# EAGLE board Arm_Board_2018 (EAGLE 8.4.1), part 1 of 2
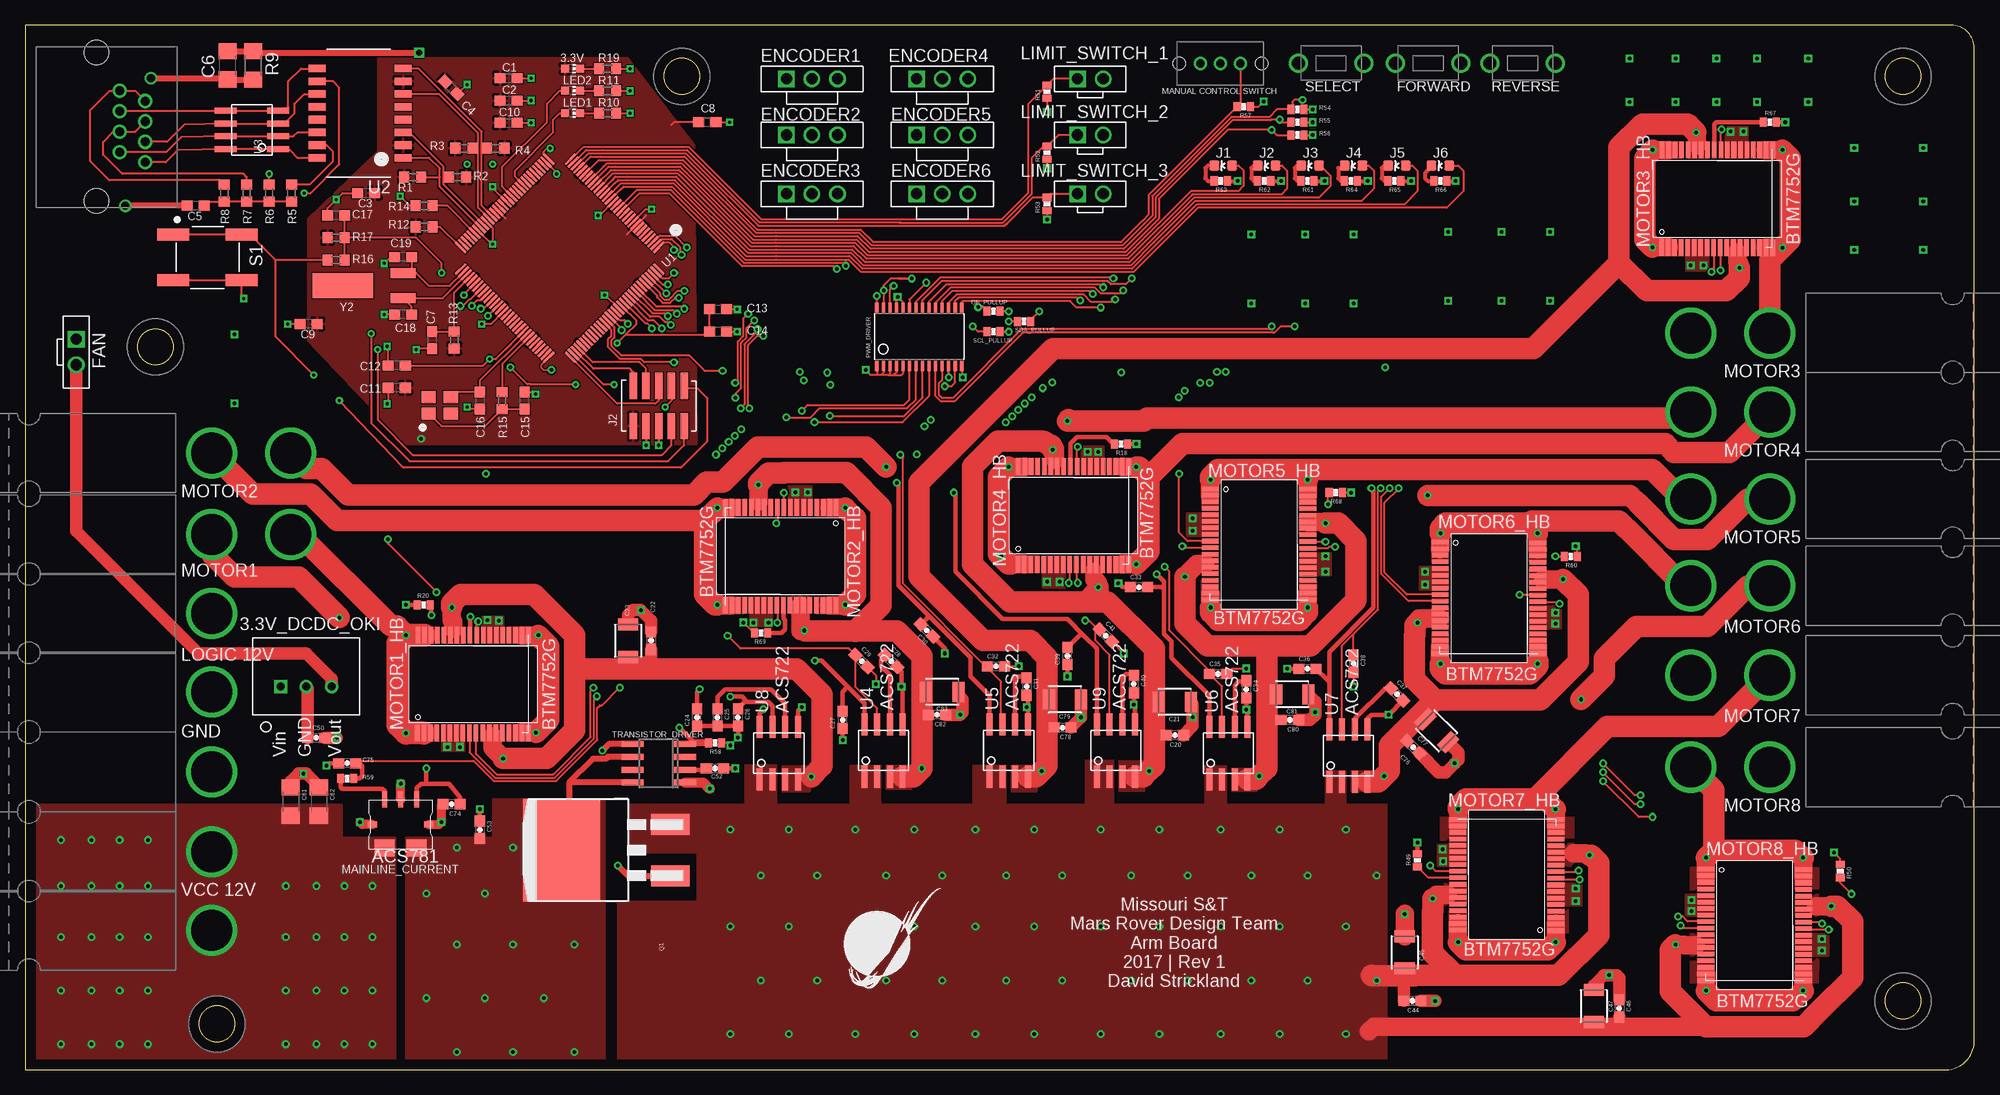
[diagram p4: board, top side]
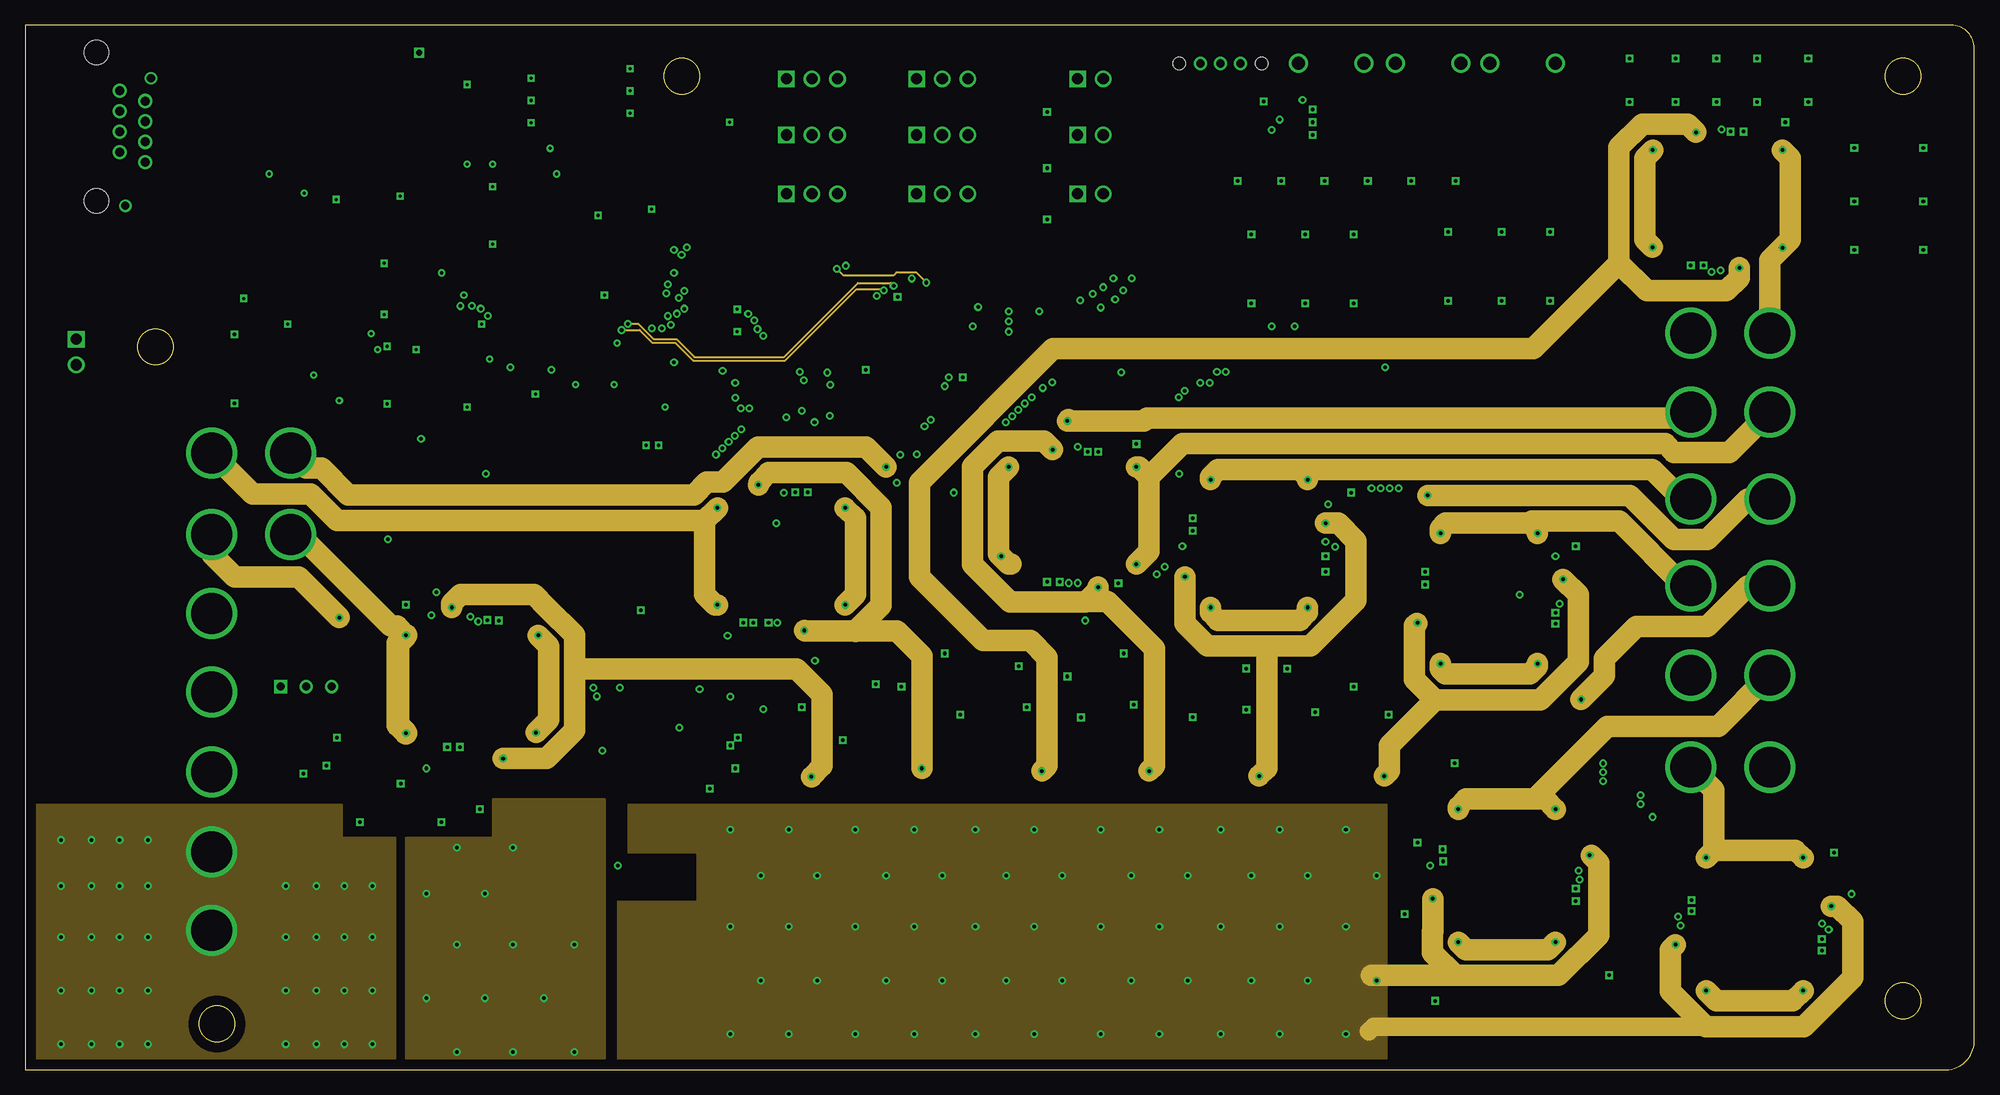
[diagram p5: board, inner layer Route2]
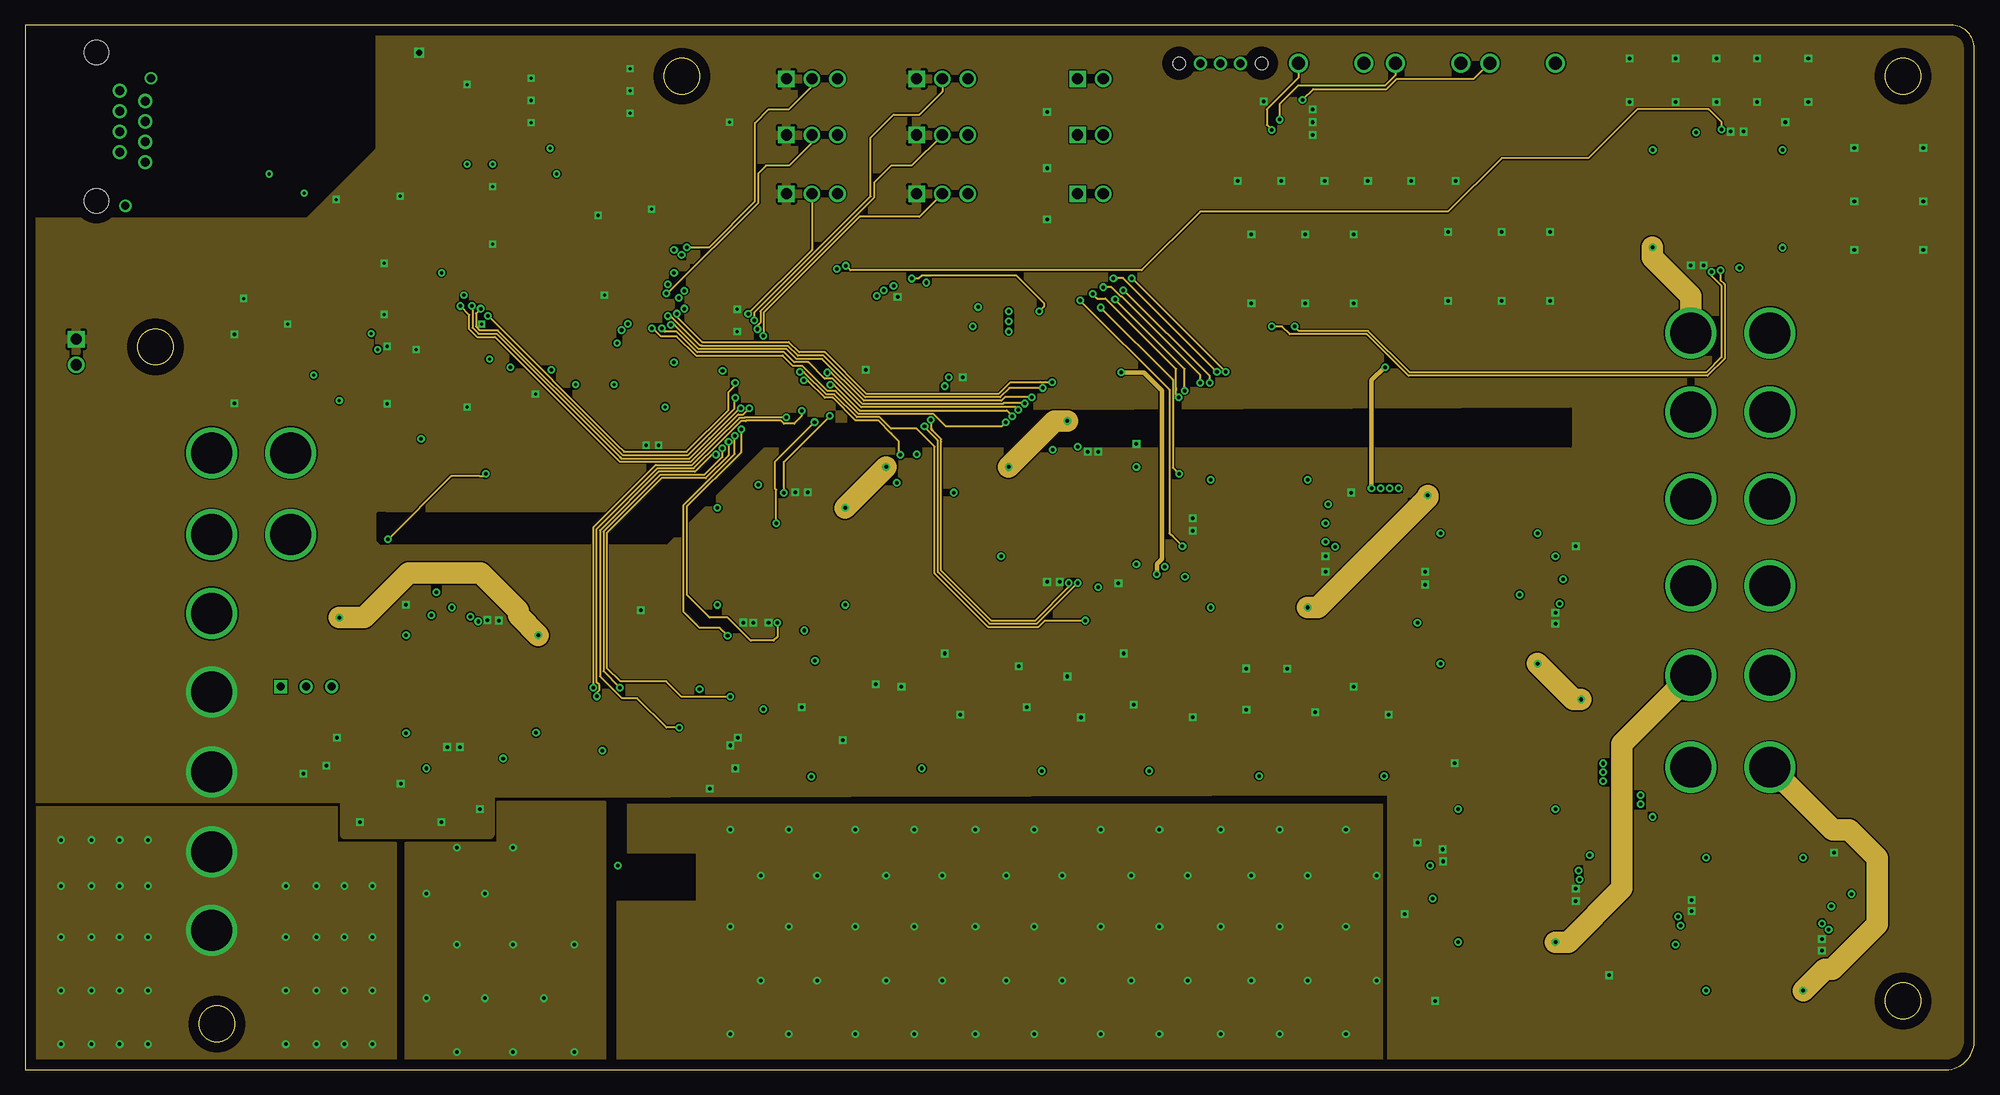
[diagram p6: board, inner layer Route15]
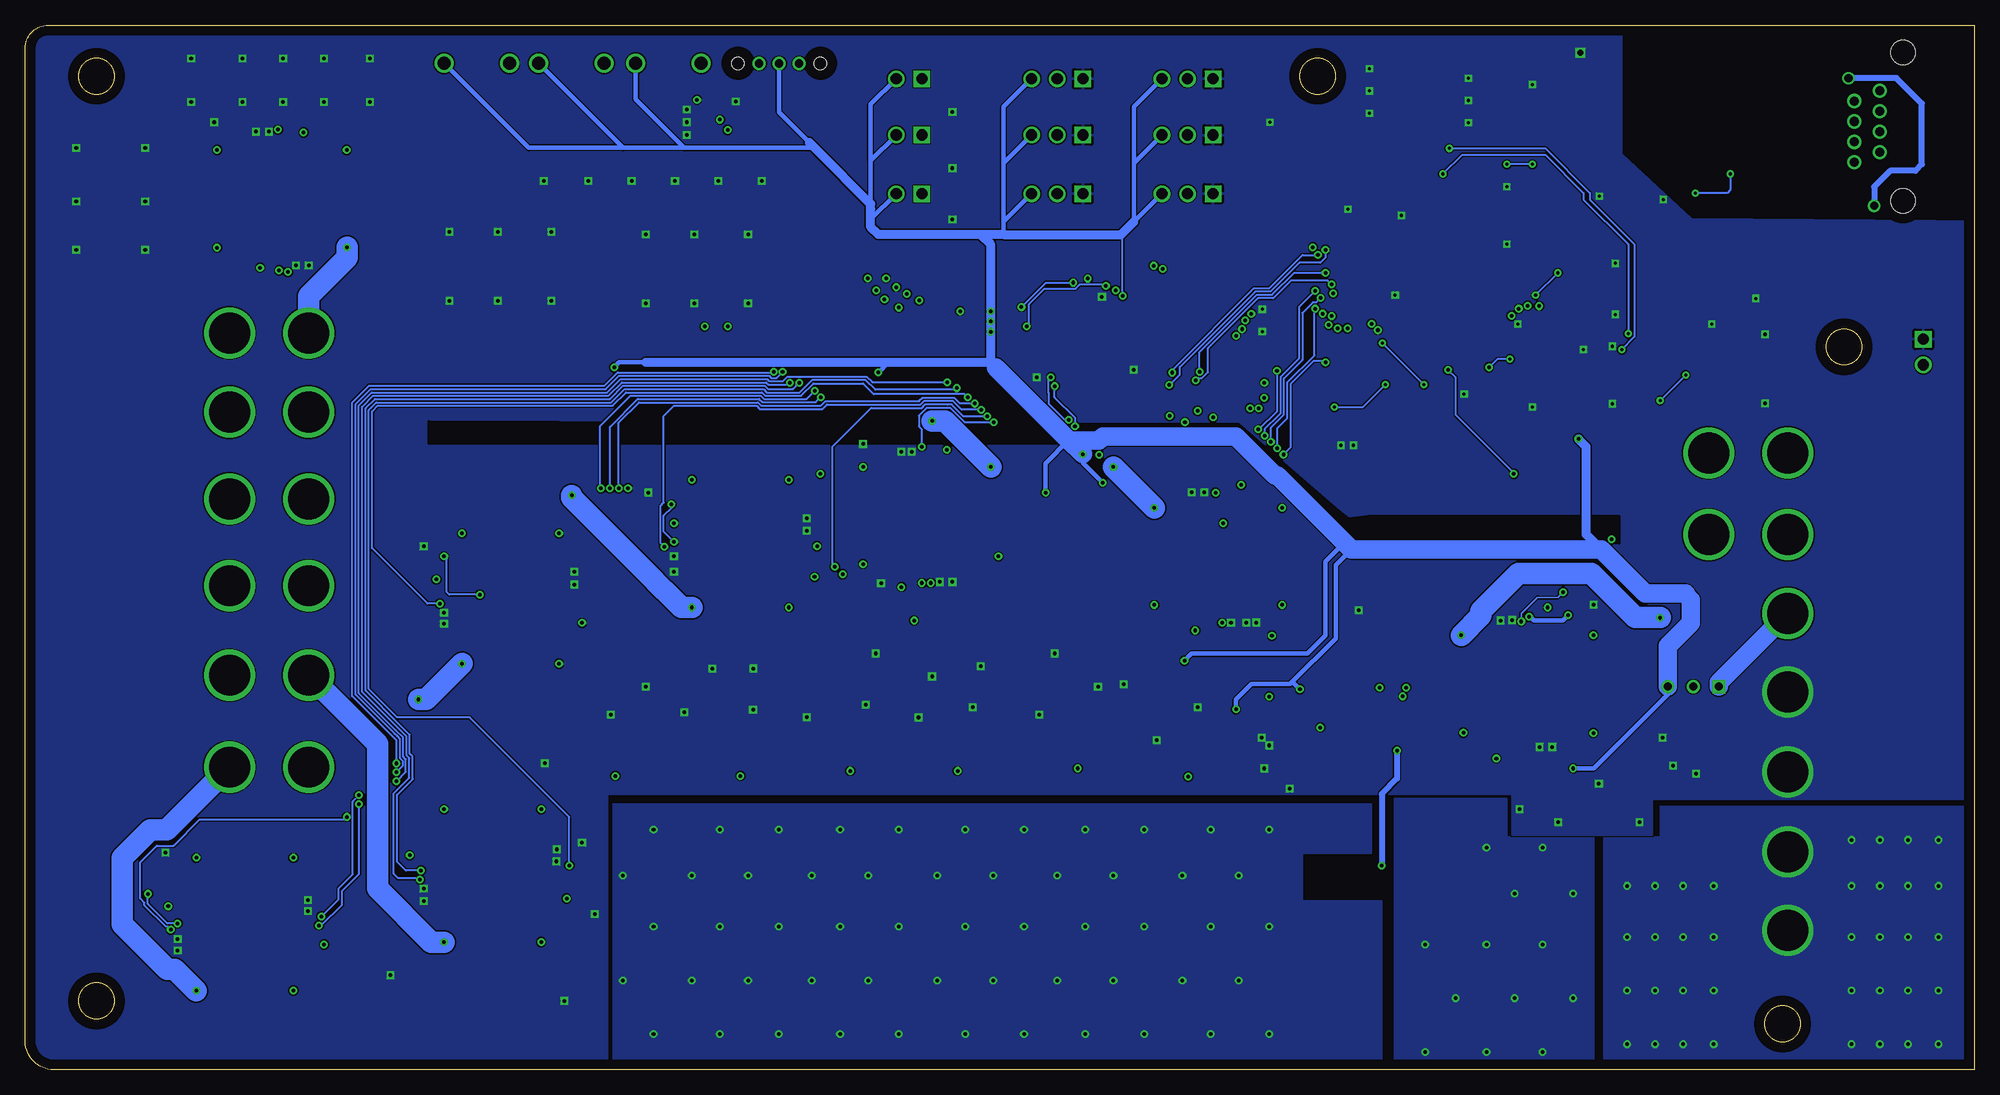
[diagram p7: board, bottom side, seen from below]

Size 193.8 x 103.89 mm. Coordinates in mm from the lower left corner, seen from the top.
Outline: 0,0 191.01,0 arc90 193.8,3.05 193.8,101.6 arc90 191.52,103.89 0,103.89 0,0
Copper layers (1*2*15*16): Top 0.07mm / dielectric 0.18mm / Route2 0.017mm / dielectric 1.12mm / Route15 0.017mm / dielectric 0.18mm / Bottom 0.07mm
Design rules "advanced_circuits_standard *": minimum track width 5mil, minimum drill 10mil, track to track 5mil, track to pad 5mil, pad to pad 5mil, via to via 5mil, smd to smd 5mil, copper to edge 40mil, drill to drill 5mil, minimum pad ring 10mil, minimum via ring 8mil, stop-mask expansion 4mil, vias tented up to drill 0mil, thermal gap 10mil
Net classes: 2 Ethernet: width 0.22 mm, clearance 0.152 mm; 3 Power Trace: width 1.829 mm, clearance 0.406 mm

## Footprints (pad centres in the part's own frame; a part is rotated, then mirrored left to right if it is on the bottom)
CHIP-LED0603 = smd 0.8 x 0.8: A 0,-0.75; C 0,0.75
Q_OKI-78SR = drill 0.8 square: 1 -2.54,0 | drill 0.8: 2 0,0; 3 2.54,0
APP45_PCB_HORIZ_RIGHT = drill 4.064: P$1 28.194,3.969
C0603 = smd 1.1 x 1: 1 -0.85,0; 2 0.85,0
C1206 = smd 1.6 x 1.8: 1 -1.4,0; 2 1.4,0
0603-CAP = smd 1.1 x 1: 1 -0.85,0; 2 0.85,0
1210 = smd 1.2 x 2: 1 -1.6,0; 2 1.6,0
1206 = smd 1.6 x 1.8: 1 -1.4,0; 2 1.4,0
LED-0603 = smd 1 x 1: A 0,-0.877; C 0,0.877
MOLEX-70543-0002 = drill 1.1 square: 1 2.54,0 | drill 1.1: 2 0,0; 3 -2.54,0
MOLEX-70543-0001 = drill 1.1 square: 1 1.27,0 | drill 1.1: 2 -1.27,0
KEYSTONE-942 = drill 0.9: P$1 3.8,2.289; P$2 4.816,4.829; P$3 5.832,2.289; P$4 6.848,4.829; P$5 7.864,2.289; P$6 8.88,4.829; P$7 9.896,2.289; P$8 10.912,4.829 | hole 2.413: -0.023,-0.023; 14.76,-0.023
CON_2X5_50MIL = smd 0.74 x 2.6: P1 0,0; P2 0,4.008; P3 1.27,0; P4 1.27,4.008; P5 2.54,0; P6 2.54,4.008; P7 3.81,0; P8 3.81,4.008; P9 5.08,0; P10 5.08,4.008
7-POWER_SMD_MODULE = smd 0.5 x 1.6: 1 -1.6,-2.5; 2 0,-2.5; 3 1.6,-2.5 | smd 0.9 x 0.6: 4 2.8,0; 7 -2.8,0 | smd 2 x 1.7: 5 1.6,2.3; 6 -1.6,2.3
APP45_HORIZ_CONFIG = drill 4.064: C1 28.194,3.937; C2 36.068,3.937
36-BSSOP = smd 1.67 x 0.45: 1 -4.86,11.05; 2 -4.86,10.4; 3 -4.86,9.75; 4 -4.86,9.1; 5 -4.86,8.45; 6 -4.86,7.8; 7 -4.86,7.15; 8 -4.86,6.5; 9 -4.86,5.85; 10 -4.86,5.2; 11 -4.86,4.55; 12 -4.86,3.9; 13 -4.86,3.25; 14 -4.86,2.6; 15 -4.86,1.95; 16 -4.86,1.3; 17 -4.86,0.65; 18 -4.87,0; 19 4.86,0; 20 4.86,0.65; 21 4.86,1.3; 22 4.86,1.95; 23 4.86,2.55; 24 4.86,3.2; 25 4.86,3.85; 26 4.86,4.5; 27 4.86,5.14; 28 4.86,5.8; 29 4.86,6.45; 30 4.86,7.1; 31 4.86,7.75; 32 4.86,8.4; 33 4.86,9.05; 34 4.86,9.7; 35 4.86,10.35; 36 4.86,11
0402-RES = smd 0.7 x 0.9: 1 -0.65,0; 2 0.65,0
TSSOP28 = smd 0.305 x 0.991: 1 -4.225,-2.918; 2 -3.575,-2.918; 3 -2.925,-2.918; 4 -2.275,-2.918; 5 -1.625,-2.918; 6 -0.975,-2.918; 7 -0.325,-2.918; 8 0.325,-2.918; 9 0.975,-2.918; 10 1.625,-2.918; 11 2.275,-2.918; 12 2.925,-2.918; 13 3.575,-2.918; 14 4.225,-2.918; 15 4.225,2.918; 16 3.575,2.918; 17 2.925,2.918; 18 2.275,2.918; 19 1.625,2.918; 20 0.975,2.918; 21 0.325,2.918; 22 -0.325,2.918; 23 -0.975,2.918; 24 -1.625,2.918; 25 -2.275,2.918; 26 -2.925,2.918; 27 -3.575,2.918; 28 -4.225,2.918
D2PACK = smd 2.083 x 3.81: 1 2.54,-4.191; 2 7.62,-4.191 | smd 10.16 x 7.62: TAB 5.08,6.604
R0603 = smd 1 x 1.1: 1 -0.85,0; 2 0.85,0
R1206 = smd 1.6 x 1.803: 1 -1.422,0; 2 1.422,0
SWITCH_6MM_6MM_TE_CON_SMD = smd 1.2 x 3.2: P$1 4.521,6.807; P$2 4.521,0; P$3 0,6.807; P$4 0,0
APEM-MJTP1243 = drill 1.27: P$1 -0.254,1.753; P$2 6.248,1.753
C&K-SS12D07VG4NSGAPA = drill 0.8: P$1 0,0; P$2 2,0; P$3 4,0 | hole 1.25: -2.1,0; 6.1,0
SO8 = smd 0.6 x 2.2: 1 -1.905,-2.6; 2 -0.635,-2.6; 3 0.635,-2.6; 4 1.905,-2.6; 5 1.905,2.6; 6 0.635,2.6; 7 -0.635,2.6; 8 -1.905,2.6
TQFP-128 = smd 1.45 x 0.25: P$1 0,0; P$2 0,-0.4; P$3 0,-0.8; P$4 0,-1.2; P$5 0,-1.6; P$6 0,-2; P$7 0,-2.4; P$8 0,-2.8; P$9 0,-3.2; P$10 0,-3.6; P$11 0,-4; P$12 0,-4.4; P$13 0,-4.8; P$14 0,-5.2; P$15 0,-5.6; P$16 0,-6; P$17 0,-6.4; P$18 0,-6.8; P$19 0,-7.2; P$20 0,-7.6; P$21 0,-8; P$22 0,-8.4; P$23 0,-8.8; P$24 0,-9.2; P$25 0,-9.6; P$26 0,-10; P$27 0,-10.4; P$28 0,-10.8; P$29 0,-11.2; P$30 0,-11.6; P$31 0,-12; P$32 0,-12.4; P$65 15.45,-12.4; P$66 15.45,-12; P$67 15.45,-11.6; P$68 15.45,-11.2; P$69 15.45,-10.8; P$70 15.45,-10.4; P$71 15.45,-10; P$72 15.45,-9.6; P$73 15.45,-9.2; P$74 15.45,-8.8; P$75 15.45,-8.4; P$76 15.45,-8; P$77 15.45,-7.6; P$78 15.45,-7.2; P$79 15.45,-6.8; P$80 15.45,-6.4; P$81 15.45,-6; P$82 15.45,-5.6; P$83 15.45,-5.2; P$84 15.45,-4.8; P$85 15.45,-4.4; P$86 15.45,-4; P$87 15.45,-3.6; P$88 15.45,-3.2; P$89 15.45,-2.8; P$90 15.45,-2.4; P$91 15.45,-2; P$92 15.45,-1.6; P$93 15.45,-1.2; P$94 15.45,-0.8; P$95 15.45,-0.4; P$96 15.45,0 | smd 0.25 x 1.45: P$33 1.525,-13.925; P$34 1.925,-13.925; P$35 2.325,-13.925; P$36 2.725,-13.925; P$37 3.125,-13.925; P$38 3.525,-13.925; P$39 3.925,-13.925; P$40 4.325,-13.925; P$41 4.725,-13.925; P$42 5.125,-13.925; P$43 5.525,-13.925; P$44 5.925,-13.925; P$45 6.325,-13.925; P$46 6.725,-13.925; P$47 7.125,-13.925; P$48 7.525,-13.925; P$49 7.925,-13.925; P$50 8.325,-13.925; P$51 8.725,-13.925; P$52 9.125,-13.925; P$53 9.525,-13.925; P$54 9.925,-13.925; P$55 10.325,-13.925; P$56 10.725,-13.925; P$57 11.125,-13.925; P$58 11.525,-13.925; P$59 11.925,-13.925; P$60 12.325,-13.925; P$61 12.725,-13.925; P$62 13.125,-13.925; P$63 13.525,-13.925; P$64 13.925,-13.925; P$97 13.925,1.525; P$98 13.525,1.525; P$99 13.125,1.525; P$100 12.725,1.525; P$101 12.325,1.525; P$102 11.925,1.525; P$103 11.525,1.525; P$104 11.125,1.525; P$105 10.725,1.525; P$106 10.325,1.525; P$107 9.925,1.525; P$108 9.525,1.525; P$109 9.125,1.525; P$110 8.725,1.525; P$111 8.325,1.525; P$112 7.925,1.525; P$113 7.525,1.525; P$114 7.125,1.525; P$115 6.725,1.525; P$116 6.325,1.525; P$117 5.925,1.525; P$118 5.525,1.525; P$119 5.125,1.525; P$120 4.725,1.525; P$121 4.325,1.525; P$122 3.925,1.525; P$123 3.525,1.525; P$124 3.125,1.525; P$125 2.725,1.525; P$126 2.325,1.525; P$127 1.925,1.525; P$128 1.525,1.525
HX1198FNL = smd 0.76 x 1.67: P$1 0,0; P$2 1.27,0; P$3 2.54,0; P$4 3.81,0; P$5 5.08,0; P$6 6.35,0; P$7 7.62,0; P$8 8.89,0; P$9 8.89,8.55; P$10 7.62,8.55; P$11 6.35,8.55; P$12 5.08,8.55; P$13 3.81,8.55; P$14 2.54,8.55; P$15 1.27,8.55; P$16 0,8.55
SOIC8 = smd 2.2 x 0.6: 1 -2.6,1.905; 2 -2.6,0.635; 3 -2.6,-0.635; 4 -2.6,-1.905; 5 2.6,-1.905; 6 2.6,-0.635; 7 2.6,0.635; 8 2.6,1.905
NDK3.2X2.5 = smd 1.4 x 1.2: P$1 0,0; P$2 2.2,0; P$3 2.2,1.6; P$4 0,1.6
CRYSTAL_32K_SMD = smd 2.5 x 1: P$1 0,1.25; P$2 0,-1.25 | smd 6 x 2.5: P$3 -6,0

## Placement (x,y rotation side)
3.3V  ORANGE  [CHIP-LED0603]  54.42,99.57 270 top
3.3V_DCDC_OKI  Q_OKI-78SR  [Q_OKI-78SR]  27.94,38.1 0 top
12V_LOGIC_IN  APPPP45_PCB_HORIZ_RIGHT  [APP45_PCB_HORIZ_RIGHT]  -9.65,41.4 0 top
C1  0.1uF  [C0603]  48.07,98.62 0 top
C2  0.1uF  [C0603]  48.07,96.39 0 top
C3  0.1uF  [C0603]  33.91,87.19 180 top
C4  0.1uF  [C0603]  42.35,97.66 315 top
C5  1000pF  [C0603]  16.95,85.92 180 top
C6  4700pF  [C1206]  20.13,99.89 90 top
C7  0.1uF  [C0603]  40.45,72.58 270 top
C8  0.1uF  [C0603]  67.82,94.23 0 top
C9  0.1uF  [C0603]  28.19,74.17 180 top
C10  0.1uF  [C0603]  48.07,94.17 0 top
C11  0.1uF  [C0603]  36.96,67.82 180 top
C12  0.1uF  [C0603]  36.96,70.04 180 top
C13  1.0uF  [C0603]  68.9,75.63 0 top
C14  2.2uF  [C0603]  68.9,73.41 0 top
C15  12pF  [C0603]  49.66,66.55 90 top
C16  12pF  [C0603]  45.21,66.55 270 top
C17  0.1uF  [C0603]  30.92,84.96 180 top
C18  12pF  [C0603]  37.59,75.12 180 top
C19  12pF  [C0603]  37.59,80.84 180 top
C20  .1uF  [0603-CAP]  114.3,33.27 180 top
C21  100uF  [1210]  114.3,36.58 180 top
C22  .1uF  [0603-CAP]  62.23,42.67 270 top
C23  100uF  [1210]  59.94,42.67 270 top
C24  0.1uF  [0603-CAP]  66.8,35.05 90 top
C25  1nF  [0603-CAP]  68.83,35.05 270 top
C26  0.1uF  [0603-CAP]  70.87,35.05 270 top
C27  0.1uF  [0603-CAP]  81.28,34.8 90 top
C28  1nF  [0603-CAP]  86.11,40.64 315 top
C29  0.1uF  [0603-CAP]  83.16,40.64 315 top
C30  0.1uF  [0603-CAP]  89.66,43.69 135 top
C31  1nF  [0603-CAP]  99.57,38.1 270 top
C32  0.1uF  [0603-CAP]  96.52,40.13 0 top
C33  0.1uF  [0603-CAP]  110.74,48.01 0 top
C34  1nF  [0603-CAP]  121.41,37.85 270 top
C35  0.1uF  [0603-CAP]  118.62,39.37 0 top
C36  0.1uF  [0603-CAP]  127.51,39.88 0 top
C37  1nF  [0603-CAP]  136.4,37.34 315 top
C38  0.1uF  [0603-CAP]  132.08,40.39 270 top
C39  0.1uF  [0603-CAP]  103.63,41.15 90 top
C40  1nF  [0603-CAP]  110.24,38.35 270 top
C41  0.1uF  [0603-CAP]  107.44,43.18 315 top
C44  .1uF  [0603-CAP]  137.92,6.86 180 top
C45  100uF  [1210]  137.16,11.68 270 top
C46  .1uF  [0603-CAP]  158.5,6.1 270 top
C47  100uF  [1210]  155.96,6.35 270 top
C50  2.2uF  [0603-CAP]  28.96,33.02 0 top
C52  1.0uF  [0603-CAP]  68.58,29.97 0 top
C53  10uF  [0603-CAP]  45.21,23.88 270 top
C61  2.2uF  [1206]  26.42,26.67 270 top
C62  2.2uF  [1206]  29.21,26.67 270 top
C74  0.1uF  [0603-CAP]  42.42,26.42 180 top
C75  1nF  [0603-CAP]  32,30.48 180 top
C76  .1uF  [0603-CAP]  138.01,32.09 135 top
C77  100uF  [1210]  140.34,33.71 135 top
C78  .1uF  [0603-CAP]  103.12,34.04 180 top
C79  100uF  [1210]  103.38,36.83 180 top
C80  .1uF  [0603-CAP]  125.73,34.8 180 top
C81  100uF  [1210]  125.98,37.34 180 top
C82  .1uF  [0603-CAP]  90.68,35.31 180 top
C83  100uF  [1210]  91.19,37.59 180 top
D1  J1  [LED-0603]  119.13,89.92 90 top
D2  J2  [LED-0603]  123.44,89.92 90 top
D3  J3  [LED-0603]  127.76,89.92 90 top
D4  J4  [LED-0603]  132.08,89.92 90 top
D5  J5  [LED-0603]  136.4,89.92 90 top
D6  J6  [LED-0603]  140.72,89.92 90 top
ENCODER1  ENCODER  [MOLEX-70543-0002]  78.23,98.55 180 top
ENCODER2  ENCODER  [MOLEX-70543-0002]  78.23,92.96 180 top
ENCODER3  ENCODER  [MOLEX-70543-0002]  78.23,87.12 180 top
ENCODER4  ENCODER  [MOLEX-70543-0002]  91.19,98.55 180 top
ENCODER5  ENCODER  [MOLEX-70543-0002]  91.19,92.96 180 top
ENCODER6  ENCODER  [MOLEX-70543-0002]  91.19,87.12 180 top
FAN  SL02  [MOLEX-70543-0001]  5.08,71.37 90 top
GND  APPPP45_PCB_HORIZ_RIGHT  [APP45_PCB_HORIZ_RIGHT]  -9.65,33.59 0 top
GROUND  APPPP45_PCB_HORIZ_RIGHT  [APP45_PCB_HORIZ_RIGHT]  -9.65,25.65 0 top
J1  RJ45KEYSTONE-942  [KEYSTONE-942]  7.11,101.16 270 top
J2  JTAG_ARM_10PIN  [CON_2X5_50MIL]  60.45,64.01 0 top
LED1  GREEN  [CHIP-LED0603]  54.42,95.12 270 top
LED2  GREEN  [CHIP-LED0603]  54.42,97.35 270 top
LIMIT_SWITCH_1  SL02  [MOLEX-70543-0001]  105.92,98.55 180 top
LIMIT_SWITCH_2  SL02  [MOLEX-70543-0001]  105.92,92.96 180 top
LIMIT_SWITCH_3  SL02  [MOLEX-70543-0001]  105.92,87.12 180 top
MAINLINE_CURRENT  ACS781  [7-POWER_SMD_MODULE]  37.34,24.38 180 top
MOTOR1  APP_2POS_CONFIGGENERAL_CONFIG  [APP45_HORIZ_CONFIG]  -9.65,49.28 0 top
MOTOR1_HB  BTM7752G  [36-BSSOP]  50.04,38.35 90 top
MOTOR2  APP_2POS_CONFIGGENERAL_CONFIG  [APP45_HORIZ_CONFIG]  -9.65,57.4 0 top
MOTOR2_HB  BTM7752G  [36-BSSOP]  69.6,51.05 270 top
MOTOR3  APP_2POS_CONFIGGENERAL_CONFIG  [APP45_HORIZ_CONFIG]  201.68,77.22 180 top
MOTOR3_HB  BTM7752G  [36-BSSOP]  173.74,86.61 90 top
MOTOR4  APP_2POS_CONFIGGENERAL_CONFIG  [APP45_HORIZ_CONFIG]  201.68,69.34 180 top
MOTOR4_HB  BTM7752G  [36-BSSOP]  109.73,55.12 90 top
MOTOR5  APP_2POS_CONFIGGENERAL_CONFIG  [APP45_HORIZ_CONFIG]  201.68,60.71 180 top
MOTOR5_HB  BTM7752G  [36-BSSOP]  122.68,46.74 0 top
MOTOR6  APP_2POS_CONFIGGENERAL_CONFIG  [APP45_HORIZ_CONFIG]  201.68,52.07 180 top
MOTOR6_HB  BTM7752G  [36-BSSOP]  145.54,41.4 0 top
MOTOR7  APP_2POS_CONFIGGENERAL_CONFIG  [APP45_HORIZ_CONFIG]  201.68,43.18 180 top
MOTOR7_HB  BTM7752G  [36-BSSOP]  147.32,24.89 180 top
MOTOR8  APP_2POS_CONFIGGENERAL_CONFIG  [APP45_HORIZ_CONFIG]  201.68,34.04 180 top
MOTOR8_HB  BTM7752G  [36-BSSOP]  171.96,8.89 0 top
OE_PULLUP  10K  [0402-RES]  96.27,75.44 180 top
POWER_12V  APPPP45_PCB_HORIZ_RIGHT  [APP45_PCB_HORIZ_RIGHT]  -9.65,17.72 0 top
POWER_12V2  APPPP45_PCB_HORIZ_RIGHT  [APP45_PCB_HORIZ_RIGHT]  -9.65,9.91 0 top
PWM_DRIVER  [TSSOP28]  88.9,72.9 0 top
Q1  Q_IRF7437SMD  [D2PACK]  59.94,16.76 90 top
R1  49.9  [R0603]  38.54,88.77 0 top
R2  49.4  [R0603]  42.99,88.77 180 top
R3  49.9  [R0603]  43.62,91.63 0 top
R4  49.9  [R0603]  46.8,91.63 180 top
R5  75  [R0603]  26.48,87.19 90 top
R6  75  [R0603]  24.26,87.19 90 top
R7  75  [R0603]  22.03,87.19 90 top
R8  75  [R0603]  19.81,87.19 90 top
R9  1M  [R1206]  22.67,99.89 270 top
R10  330  [R0603]  57.91,95.12 0 top
R11  330  [R0603]  57.91,97.35 0 top
R12  1M  [R0603]  39.69,83.82 180 top
R13  51  [R0603]  42.67,72.58 270 top
R14  4.87k 1%  [R0603]  39.69,85.92 0 top
R15  2k  [R0603]  47.43,66.55 90 top
R16  100  [R0603]  30.92,80.52 180 top
R17  10k  [R0603]  30.92,82.74 0 top
R18  10K  [0402-RES]  108.97,62.23 180 top
R19  330  [R0603]  57.91,99.57 0 top
R20  10K  [0402-RES]  39.62,46.23 0 top
R49  10K  [0402-RES]  138.43,20.83 270 top
R50  10K  [0402-RES]  180.47,19.76 270 top
R51  10K  [0402-RES]  101.6,97.28 90 top
R52  10K  [0402-RES]  101.6,91.19 90 top
R53  10K  [0402-RES]  101.6,86.11 90 top
R54  10k  [0402-RES]  126.49,95.5 0 top
R55  10k  [0402-RES]  126.49,94.23 0 top
R56  10k  [0402-RES]  126.49,92.96 0 top
R57  10k  [0402-RES]  121.16,95.76 0 top
R58  10K  [0402-RES]  68.58,32.51 180 top
R59  1K  [0402-RES]  32,28.96 180 top
R60  10K  [0402-RES]  153.67,51.05 180 top
R61  330  [0402-RES]  127.51,88.39 180 top
R62  330  [0402-RES]  123.19,88.39 180 top
R63  330  [0402-RES]  118.87,88.39 180 top
R64  330  [0402-RES]  131.83,88.39 180 top
R65  330  [0402-RES]  136.14,88.39 180 top
R66  330  [0402-RES]  140.72,88.39 180 top
R67  10K  [0402-RES]  173.48,94.23 180 top
R68  10K  [0402-RES]  130.3,57.4 180 top
R69  10K  [0402-RES]  73.15,43.43 0 top
S1  SWITCH_TACTILE  [SWITCH_6MM_6MM_TE_CON_SMD]  14.73,83.06 270 top
S2  PUSHBUTTONVERT  [APEM-MJTP1243]  132.84,101.85 180 top
S3  PUSHBUTTONVERT  [APEM-MJTP1243]  142.49,101.85 180 top
S4  PUSHBUTTONVERT  [APEM-MJTP1243]  151.89,101.85 180 top
S5  SWITCH-SPDTVERT  [C&K-SS12D07VG4NSGAPA]  116.84,100.08 0 top
SCL_PULLUP  1K  [0402-RES]  96.27,73.41 180 top
SDA_PULLUP  1K  [0402-RES]  99.31,74.42 0 top
TRANSISTOR_DRIVER  LT1910  [SO8]  62.99,30.48 90 top
U1  TM4C1294NCPDT  [TQFP-128]  62.99,81.79 225 top
U2  HX1198FNL  [HX1198FNL]  37.59,90.68 90 top
U3  SLVU2.8-4  [SOIC8]  22.54,93.47 180 top
U4  ACS722  [SOIC8]  85.34,31.75 90 top
U5  ACS722  [SOIC8]  97.79,31.75 90 top
U6  ACS722  [SOIC8]  119.63,31.5 90 top
U7  ACS722  [SOIC8]  131.57,31.24 90 top
U8  ACS722  [SOIC8]  74.93,31.5 90 top
U9  ACS722  [SOIC8]  108.46,31.75 90 top
U$1  MRDT_LOGO  [MRDT_LOGO]  81.41,7.24 0 top
U$2  MOUNTING_HOLE#6  [#6_SCREW]  186.69,98.81 0 top
U$3  MOUNTING_HOLE#6  [#6_SCREW]  12.95,71.88 0 top
U$4  MOUNTING_HOLE#6  [#6_SCREW]  65.28,98.81 0 top
U$5  MOUNTING_HOLE#6  [#6_SCREW]  19.05,4.57 0 top
U$30  MOUNTING_HOLE#6  [#6_SCREW]  186.69,6.86 0 top
Y1  NX3225GA  [NDK3.2X2.5]  40.13,65.28 0 top
Y2  CRYATL_32K_SMD  [CRYSTAL_32K_SMD]  37.59,77.98 0 top

## Tracks (layer width: path | path; a pad name or v marks a point on that pad's centre or on a via)
12VMOTOR_POWER  (via drill 0.35)
  Top 1.219: C44.2 137.07,8.94 136.65,9.36 137.16,9.87 C45.2 | C47.2 155.96,4.55 156.21,4.29 | C46.2 158.5,4.29
  Top 1.829: 141.48,17.39 140.32,17.39 v139.95,17.02 | 153.92,21.52 155.15,21.52 155.34,21.34 v155.57,21.34 | 178.08,16.26 v179.58,16.26 | v164.08,12.45 164.96,12.45 165.02,12.39 166.12,12.39 | 167.09,4.29 158.5,4.29 156.21,4.29 134.09,4.29 133.6,3.81
  Top 2.159: 142.19,9.37 152.45,9.37 156.46,13.39 156.46,20.57 155.7,21.34 v155.57,21.34 | 142.19,9.37 139.93,11.64 139.93,15.77 139.95,15.79 v139.95,17.02 | 142.19,9.37 138.17,9.37 138.15,9.36 136.65,9.36 133.9,9.36 133.86,9.4 | v164.08,12.45 163.58,11.94 163.58,7.8 167.09,4.29 176.83,4.29 178.34,5.81 178.35,5.81 181.7,9.15 181.7,14.74 180.18,16.26 v179.58,16.26
  Route2 1.829: 167.09,4.29 134.09,4.29 133.6,3.81
  Route2 2.159: 142.19,9.37 139.93,11.64 139.93,13.76 139.95,13.79 v139.95,17.02 | 142.19,9.37 152.45,9.37 156.46,13.39 156.46,20.57 155.7,21.34 | 142.19,9.37 133.88,9.37 133.86,9.4 | v179.58,16.26 180.18,16.26 181.7,14.74 181.7,9.16 176.83,4.29 167.09,4.29 163.58,7.8 163.58,11.94 v164.08,12.45
  other vias: 78.74,19.3 73.15,19.3 78.74,8.89 73.15,8.89 75.95,14.22 70.1,14.22 75.95,3.56 70.1,3.56 75.95,23.88 70.1,23.88 91.19,19.3 85.6,19.3 91.19,8.89 85.6,8.89 88.39,14.22 82.55,14.22 88.39,3.56 82.55,3.56 88.39,23.88 82.55,23.88 103.12,19.3 97.54,19.3 103.12,8.89 97.54,8.89 100.33,14.22 94.49,14.22 100.33,3.56 94.49,3.56 100.33,23.88 94.49,23.88 115.57,19.3 109.98,19.3 115.57,8.89 109.98,8.89 112.78,14.22 106.93,14.22 112.78,3.56 106.93,3.56 112.78,23.88 106.93,23.88 127.51,19.3 121.92,19.3 127.51,8.89 121.92,8.89 124.71,14.22 118.87,14.22 124.71,3.56 118.87,3.56 124.71,23.88 118.87,23.88 134.37,19.3 134.37,8.89 131.32,14.22 131.32,3.56 131.32,23.88
  pour Top (no thermals): 117.35,26.16 117.35,30.23 119.38,30.23 119.38,26.16
  pour Top (no thermals): 97.54,26.42 97.54,30.23 94.23,30.23 94.23,26.42
  pour Top (no thermals): 74.68,30.23 71.63,30.23 71.63,26.16 74.68,26.16
  pour Top (no thermals): 85.01,30.25 85.01,25.7 82.07,25.7 82.07,30.25
  pour Top (no thermals): 108.2,26.16 108.2,30.73 105.41,30.73 105.41,26.16
  pour Top (no thermals): 129.29,29.72 131.32,29.72 131.32,26.16 129.29,26.16
  pour Top (no thermals): 59.94,26.42 59.94,21.59 66.8,21.59 66.8,16.76 58.93,16.76 58.93,1.02 135.38,1.02 135.38,26.42
  pour Top (no thermals): 167.89,11.33 165.61,11.33 165.61,13.61 167.89,13.61
  pour Top (no thermals): 176.02,15.19 177.8,15.24 178.31,15.24 178.31,17.4 176.02,17.42
  pour Top (no thermals): 143.23,18.59 143.23,16.36 141.15,16.36 141.15,18.59
  pour Top (no thermals): 151.38,22.45 151.38,20.19 153.97,20.19 153.97,22.45
  pour Route2 (no thermals): 59.94,26.42 59.94,21.59 66.8,21.59 66.8,16.76 58.93,16.76 58.93,1.07 135.38,1.02 135.38,26.42
  pour Bottom (rank 2): 59.94,26.42 135.38,26.42 135.38,1.02 58.93,1.02 58.93,16.76 66.8,16.76 66.8,21.59 59.94,21.59
  pour Route15 (rank 2): 59.94,26.42 135.13,26.42 135.13,1.02 58.93,1.02 58.93,16.76 66.8,16.76 66.8,21.59 59.94,21.59
!RESET  (via drill 0.3)
  Top 0.203: J2.P10 65.73,67.82 66.8,67.82 67.82,66.8 67.82,62.48 65.22,59.88 37.59,59.88 v31.24,66.55 | v28.7,69.09 24.89,72.9 24.89,80.52 | R16.2 24.89,80.52 | 24.89,80.52 22.35,83.06 S1.P$3 S1.P$4
  Bottom 0.203: v31.24,66.55 v28.7,69.09
+3V3  (via drill 0.3)
  Bottom 0.203: v43.94,90.04 v46.48,90.04
BUTTON1  (via drill 0.35)
  Top 0.203: R56.1 124.46,92.96 v123.95,93.47 119.59,93.47 112.72,86.61 112.72,84.65 109.38,81.31 83.92,81.31 82.65,82.58 74.68,82.58 74.62,82.58 72.38,82.58 65.72,89.23 | 58.75,89.81 | 58.75,89.81 58.01,89.81 U1.P$24 | 64.87,89.81 | 64.87,89.81 65.14,89.81 65.72,89.23 | 65.72,89.23 | 58.75,89.81 64.87,89.81
  Route15 0.203: S2.P$2 126.59,98.65 123.44,95.5 123.44,93.98 v123.95,93.47
BUTTON2  (via drill 0.35)
  Top 0.203: R55.1 124.97,94.23 v124.71,94.49 123.91,94.49 123.83,94.41 120.06,94.41 112.39,86.75 112.39,84.79 109.24,81.64 84.05,81.64 82.78,82.91 74.68,82.91 74.62,82.91 72.52,82.91 66.05,89.37 | U1.P$25 56.27,88.58 57.38,89.69 57.51,89.81 57.84,90.14 65.28,90.14 66.05,89.37 | 66.05,89.37
  Route15 0.203: S3.P$2 136.25,98.91 135.2,97.87 126.57,97.87 124.71,96.01 v124.71,94.49
BUTTON3  (via drill 0.35)
  Top 0.203: v127,96.46 126.18,96.46 125.98,96.27 125.98,95.65 R54.1 124.46,95.5 123.7,94.74 119.92,94.74 112.06,86.88 112.06,84.93 109.1,81.97 84.19,81.97 82.92,83.24 74.68,83.24 74.62,83.24 72.65,83.24 66.38,89.51 | U1.P$27 55.7,89.14 57.04,90.47 65.42,90.47 66.38,89.51 | 66.38,89.51
  Route15 0.203: v127,96.46 128.08,97.54 135.35,97.54 136.37,98.55 144.02,98.55 145.57,100.1 S4.P$2
EN0LED0
  Top 0.203: U1.P$42 48.7,88.83 48.7,89.41 52.51,93.22 52.51,94.49 53.15,95.12 LED1.A
EN0LED1
  Top 0.203: U1.P$46 47.43,87.83 47.43,89.79 51.88,94.23 51.88,96.08 53.15,97.35 LED2.A
EN0RXI_N
  Top 0.22: 45.4,91.63 45.4,85.91 U1.P$53 | 45.4,91.63 45.4,93.3 39.12,99.57 U2.P$8 | R4.2 45.4,91.63
EN0RXI_P
  Top 0.22: 45.03,91.63 45.03,85.72 U1.P$54 | 45.03,91.63 45.03,93.14 41.14,97.03 U2.P$6 | R3.2 45.03,91.63
EN0TXO_N
  Top 0.22: U1.P$56 41.59,88.02 41.59,88.77 | 41.59,88.77 41.59,89.8 38.17,93.22 U2.P$3 | R2.2 41.59,88.77
EN0TXO_P
  Top 0.22: U1.P$57 41.22,87.83 41.22,88.77 | 41.22,88.77 41.22,89.65 40.19,90.68 U2.P$1 | R1.2 41.22,88.77
ENCODER_1  (via drill 0.35)
  Top 0.203: U1.P$3 62.49,82.35 63.09,82.96 64.6,82.96 v65.78,81.78
  Route15 0.203: ENCODER1.2 78.23,97.79 75.95,95.5 73.91,95.5 72.57,94.16 72.57,86.36 67.98,81.78 v65.78,81.78
ENCODER_2  (via drill 0.35)
  Top 0.203: U1.P$125 63.71,77.22 v63.75,77.22
  Route15 0.203: ENCODER2.2 78.23,92.2 75.95,89.92 73.66,89.92 72.9,89.15 72.9,86.5 | v63.75,77.22 63.89,77.22 72.9,86.22 72.9,86.5 | 72.9,86.5
ENCODER_3  (via drill 0.35)
  Top 0.203: U1.P$78 46.02,75 v46.02,74.98 | v71.88,75.18 71.39,74.69 71.39,72.96 70.87,72.44 70.87,68.6 v70.59,68.33
  Route15 0.203: ENCODER3.2 78.23,81.53 v71.88,75.18 | v70.59,68.33 70.59,68.05 69.92,67.38 69.92,65.61 65.79,61.47 59.53,61.47 58.88,62.12 58.85,62.15 v46.02,74.98
ENCODER_4  (via drill 0.35)
  Top 0.203: U1.P$76 45.58,75.69 v45.29,75.69 | v70.6,66.81 70.6,67.2 71.2,67.8 71.2,72.3 71.72,72.82 71.72,73.77 v72.49,74.54
  Route15 0.203: ENCODER4.2 91.19,97.28 88.9,95 86.36,95 84.07,92.71 84.07,86.87 72.49,75.28 v72.49,74.54 | v45.29,75.69 44.82,75.22 44.82,73.93 45.21,73.53 47,73.53 58.36,62.17 58.41,62.12 59.39,61.14 65.92,61.14 70.53,65.75 70.53,66.74 v70.6,66.81
ENCODER_5  (via drill 0.35)
  Top 0.203: v44.41,75.99 44.96,76.54 45.3,76.54 U1.P$74 | v72.82,73.66 72.82,73.45 71.53,72.16 71.53,67.94 | 71.53,67.94 | 71.53,67.94 71.53,66.16 v71.14,65.77
  Route15 0.203: ENCODER5.2 88.14,89.92 86.11,89.92 84.4,88.21 84.4,86.73 73.1,75.42 73.1,74.29 72.82,74.01 v72.82,73.66 | v71.14,65.77 71.02,65.77 68.03,62.78 | v44.41,75.99 44.49,75.91 44.49,73.79 45.08,73.2 46.86,73.2 59.14,60.92 | 59.14,60.92 59.26,60.81 | 59.14,60.92 59.26,60.81 | 59.26,60.81 66.06,60.81 68.03,62.78 | 68.03,62.78
ENCODER_6  (via drill 0.35)
  Top 0.203: U1.P$72 44.22,76.59 44.16,76.59 43.51,75.95 v43.28,75.95 | v72.02,65.79 71.88,65.92 71.88,72.05 72.83,73 v73.41,73
  Route15 0.203: ENCODER6.2 88.9,84.84 82.98,84.84 73.43,75.29 73.43,73.02 v73.41,73 | v43.28,75.95 44.16,75.07 44.16,73.65 44.94,72.87 46.72,72.87 59.12,60.48 66.2,60.48 68.36,62.64 | 68.36,62.64 | v72.02,65.79 v72.01,65.79 71.39,65.16 70.88,65.16 68.36,62.64
GND  (via drill 0.3, 0.35, 0.6)
  Top 0.152: R58.1 69.85,32.51 v70.1,32.26
  Top 0.203: U1.P$58 46.38,82.11 v46.48,82.11 46.48,83.7 U1.P$55 | U1.P$48 46.48,87.66 v46.48,87.82 | U1.P$17 57.12,84.96 v56.96,84.96 | C18.2 v35.69,75.12 | C19.2 36.32,80.83 v35.69,80.2 | C9.2 v26.1,74.17 | U1.P$114 57.68,77.03 v57.59,77.03 | C4.2 43.16,97.2 v43.94,97.98 | U1.P$80 46.32,74.17 v45.4,74.17 | C17.2 30.07,85.7 v30.92,86.55 31.56,87.19 C3.2 | C16.2 44.16,65.7 v43.94,65.91 | C15.2 50.52,67.4 v50.74,67.18 | R14.1 38.23,85.92 v37.27,86.87 | S1.P$2 S1.P$1 21.54,76.89 v21.72,76.71 | C7.2 38.97,71.73 v38.86,71.63 | C12.2 36.11,71.84 v36.01,71.94 | C11.2 36.11,66.33 v36.01,66.23 | C14.2 v70.8,73.41 | C13.2 v70.8,75.63 | U1.P$10 61.71,85.6 v62.29,85.6 | R10.2 v60.13,95.12 | R11.2 v60.13,97.35 | R19.2 v60.13,99.57 | C10.2 v50.29,94.17 | C2.2 v50.29,96.39 | C1.2 v50.29,98.61 | C8.2 v70.04,94.23 | J2.P3 v61.72,62.1 | J2.P5 v62.99,62.1 | R52.1 v101.6,89.66 | R56.2 v128.02,92.96 | R55.2 v128.02,94.23 | R54.2 v128.02,95.5 | R50.1 180.47,20.95 v179.83,21.59 | R51.1 v101.6,95.25 | R53.1 v101.6,84.58 | PWM_DRIVER.14 93.12,68.99 v93.24,68.88 | MAINLINE_CURRENT.4 | R69.1 72.45,43.43 v71.41,44.48 | MAINLINE_CURRENT.7 | R57.2 122.62,95.76 v123.16,96.3 | PWM_DRIVER.25 86.62,76.75 v86.74,76.86 87.28,76.33 PWM_DRIVER.24 | C29.2 84.58,39.22 v84.58,38.35 | C32.2 97.39,40.15 v98.78,40.15 | R68.1 131.21,57.4 v131.83,57.4 | 99.69,36.07 v99.58,36.07 | C41.2 | C41.2 v109.22,41.4 | C35.2 120.01,39.91 v121.41,39.91 | C38.2 v132.08,38.1 | R60.1 154.32,51.93 v154.18,52.07 | PWM_DRIVER.5 87.28,69.24 87.12,69.09 86.36,69.09 | 85.09,69.09 84.58,69.09 | 85.85,69.09 86.36,69.09 | 85.85,69.09 85.09,69.09 | 84.58,69.09 84.07,69.09 v83.57,69.6 | PWM_DRIVER.1 84.67,69.18 84.58,69.09 | PWM_DRIVER.2 85.33,69.32 85.09,69.09
  Top 0.203: PWM_DRIVER.4 86.62,69.35 86.36,69.09 | 85.85,69.09 85.97,69.21 PWM_DRIVER.3
  Top 0.406: R66.1 v142.24,88.39 | R65.1 v137.82,88.39 | R64.1 v133.5,88.39 | R61.1 v129.18,88.39 | R62.1 v124.86,88.39 | R63.1 v120.55,88.39
  Top 0.457: C52.2 v70.61,29.97 | C53.1 v45.21,25.91 | C75.2 30.23,30.48 v29.97,30.23 | R49.1 v138.43,22.61 | R20.1 38.04,46.23 v37.87,46.23 | R18.1 v110.49,62.23 | R67.1 v175.01,94.23 | U8.5 76.83,35.68 v77.23,36.07 | C24.1 C25.2 C26.2 v70.87,33.02 | U4.5 87.25,37.98 v87.13,38.1 87.13,39.61 C28.2 | C27.1 v81.28,32.77 | U5.5 99.69,36.07 99.69,37.12 C31.2 | C30.1 91.44,41.91 v91.44,41.4 | C40.2 v110.24,36.32 110.36,36.2 U9.5 | C39.1 v103.63,39.12 | C34.2 121.42,36.98 v121.42,35.81 121.54,35.7 U6.5 | C33.1 109.1,48.01 v108.7,48.4 | C36.1 v125.48,39.88 | U7.5 133.48,34.92 133.86,35.31 v135.57,35.31 C37.2
  Top 0.61: C6.2 20.15,101.31 R9.1 22.82,101.16 v39.18,101.16
  Top 0.914: MAINLINE_CURRENT.2 v37.34,28.45 | MAINLINE_CURRENT.7 41.15,24.38 v41.4,24.64 41.4,26.25 C74.2 | MAINLINE_CURRENT.4 33.53,24.38 v33.27,24.64
  Top 1.016: TRANSISTOR_DRIVER.1 67.44,28.57 v68.07,27.94
  Top 1.219: C46.1 158.5,9.14 158.24,9.4 v157.48,9.4 156.97,9.4 155.96,8.38 C47.1 | C62.1 29.21,28.19 27.94,29.46 v27.69,29.46 27.18,29.46 26.42,28.7 C61.1 | C50.2 v30.99,33.02 | C44.1 v140.21,6.86 | C76.1 140.52,29.58 141.24,29.58 v142.14,30.48 142.5,30.83 142.5,31.55 C77.1 | C80.1 127.76,34.8 128.27,35.31 v128.27,35.56 128.27,36.65 C81.1 | C20.1 116.08,34.2 v116.08,35.05 116.08,36.4 C21.1 | C79.1 v104.98,35.04 C78.1 | C23.1 59.94,45.21 60.45,45.72 v61.21,45.72 62.23,44.7 C22.1 | C83.1 92.79,37.26 93.22,36.83 93.22,35.56 v92.96,35.31 C82.1
  Top 1.829: C45.1 v137.16,15.49
  other vias: 154.18,16.76 140.94,21.92 140.97,20.73 45.95,44.73 47.12,44.68 41.96,32.11 43.21,32.11 165.68,15.77 165.68,16.87 178.64,11.86 178.64,12.98 154.18,18.03 139.19,49.53 139.19,48.26 152.15,45.47 152.15,44.35 116.08,54.86 116.08,53.59 129.29,51.05 129.29,49.53 106.68,61.47 105.66,61.47 102.87,48.51 101.6,48.51 169.57,93.29 170.87,93.29 165.61,80.01 166.88,80.01 76.58,57.43 77.8,57.43 72.39,44.45 73.91,44.45 159.51,100.58 164.08,100.58 168.15,100.58 172.21,100.58 177.29,100.58 177.29,96.27 172.21,96.27 168.15,96.27 164.08,96.27 159.51,96.27 181.86,91.69 188.72,91.69 188.72,86.36 181.86,86.36 181.86,81.53 188.72,81.53 121.92,76.2 121.92,83.06 127.25,83.06 127.25,76.2 132.08,76.2 132.08,83.06 141.48,76.45 141.48,83.31 146.81,83.31 146.81,76.45 151.64,76.45 151.64,83.31 20.83,73.15 20.83,66.29
  pour Bottom: -2.29,84.33 28.07,84.58 35.05,91.06 35.05,104.65 196.09,104.65 196.09,-2.03 135.89,-1.78 135.89,27.43 45.97,27.43 45.97,23.37 32,23.37 32,26.92 -2.29,26.92
  pour Top (rank 2, no thermals): 176.02,11.33 179.32,11.33 179.32,13.46 176.02,13.46
  pour Top (rank 2, no thermals): 167.89,15.24 165.1,15.24 165.1,17.42 167.89,17.42
  pour Top (rank 2, no thermals): 151.41,18.54 154.74,18.54 154.74,16.28 151.41,16.28
  pour Top (rank 2, no thermals): 143.21,22.4 143.21,20.22 140.49,20.24 140.49,22.4
  pour Route15: -2.79,84.33 28.19,84.33 35.31,91.44 35.31,104.65 197.36,104.65 197.36,-1.52 197.1,-1.78 135.89,-1.52 135.89,27.69 46.23,27.43 46.23,23.37 31.75,23.37 31.75,26.92 -2.79,26.92
  pour Top (rank 2, no thermals): 43.71,34.29 43.71,31.67 41.43,31.67 41.43,34.29
  pour Top (rank 2, no thermals): 47.57,45.06 47.57,42.44 45.36,42.44 45.36,45.06
  pour Top (rank 2, no thermals): 149.61,46.1 152.73,46.1 152.73,43.84 149.61,43.84
  pour Top (rank 2, no thermals): 138.61,50.04 141.5,50.04 141.5,47.7 138.61,47.7
  pour Top (rank 2, no thermals): 115.47,55.37 118.64,55.37 118.64,53.04 115.47,53.04
  pour Top (rank 2, no thermals): 129.9,49.17 129.9,51.41 126.75,51.41 126.75,49.17
  pour Top (no thermals): 103.43,47.9 101.17,47.9 101.17,51.05 103.43,51.05
  pour Top (rank 2, no thermals): 107.26,59.21 105.03,59.18 105.03,62.05 107.26,62.08
  pour Top (rank 2, no thermals): 165.1,79.43 165.1,82.55 167.41,82.55 167.41,79.43
  pour Top (rank 2, no thermals): 169.04,90.65 169.04,93.8 171.27,93.8 171.27,90.68 169.06,90.68
  pour Top (rank 2, no thermals): 75.9,58.22 78.23,58.22 78.23,55.12 75.9,55.12
  pour Top (rank 2, no thermals): 72.06,46.99 74.3,46.99 74.3,44.09 72.06,44.09
  cutout Bottom: 35.31,52.32 63.75,52.32 73.66,62.23 153.67,62.23 153.67,64.52 88.9,64.26 73.15,64.26 63.5,55.88 62.23,54.86 60.2,55.12 35.31,55.12
  cutout Route15: 35.81,55.37 62.23,55.37 71.12,64.26 88.65,64.26 88.65,65.53 153.67,65.79 153.67,61.98 73.41,61.98 63.75,52.32 35.31,52.32 35.05,52.58 35.05,55.37
LED1
  Top 0.203: D1.A 120.65,89.92 121.16,89.41 121.15,89.4 121.15,87.92 120.61,87.38 115.91,87.38 109.51,80.97 83.78,80.97 82.51,82.25 74.68,82.25 74.62,82.25 72.24,82.25 65.39,89.1 | 58.62,89.48 | 58.62,89.48 58.24,89.48 U1.P$23 | 65.39,89.1 | 65.39,89.1 65,89.48 58.62,89.48
LED2
  Top 0.203: D2.A 124.97,89.92 125.48,89.41 125.48,87.63 124.89,87.05 116.05,87.05 109.65,80.64 83.64,80.64 82.37,81.92 74.68,81.92 74.62,81.92 72.11,81.92 65.06,88.96 | 65.06,88.96 | 65.06,88.96 64.87,89.15 58.48,89.15 U1.P$22
LED3
  Top 0.203: D3.A 128.78,89.92 129.79,88.9 129.79,87.88 128.63,86.72 116.19,86.72 109.79,80.31 83.51,80.31 82.24,81.58 74.68,81.58 74.62,81.58 71.97,81.58 64.73,88.82 59.9,88.82 | U1.P$21 58.35,88.46 58.38,88.49 58.71,88.82 59.9,88.82 | 59.9,88.82
LED4
  Top 0.203: D4.A 133.6,89.92 134.11,89.41 134.11,87.63 132.87,86.39 116.33,86.39 112.24,82.3 112.23,82.3 109.92,79.98 83.37,79.98 82.1,81.25 71.83,81.25 64.59,88.49 59.76,88.49 | U1.P$20 58.51,88.05 58.62,88.16 58.95,88.49 59.76,88.49 | 59.76,88.49
LED5
  Top 0.203: D5.A 137.92,89.92 138.43,89.41 138.43,87.38 137.11,86.06 116.47,86.06 110.07,79.65 83.23,79.65 81.96,80.92 74.68,80.92 74.62,80.92 71.7,80.92 64.46,88.16 59.62,88.16 | U1.P$19 57.93,86.85 59.25,88.16 59.62,88.16 | 59.62,88.16
LED6
  Top 0.203: D6.A 142.49,89.92 143,89.41 143,87.38 141.35,85.72 116.61,85.72 110.2,79.32 83.1,79.32 81.85,80.58 74.68,80.58 74.62,80.58 71.58,80.58 64.32,87.83 59.49,87.83 59.16,87.5 59.1,87.45 58.22,86.56 U1.P$18
LIMIT_SWITCH_1
  Top 0.203: LIMIT_SWITCH_1.1 102.22,98.55 R51.2 99.74,96.07 99.74,87.21 97.11,84.58 73.18,84.58 65.96,91.8 55.53,91.8 54.29,90.56 U1.P$32
LIMIT_SWITCH_2
  Top 0.203: LIMIT_SWITCH_2.1 102.73,92.96 R52.2 101.23,91.84 100.08,90.68 100.08,87.08 97.25,84.25 86.87,84.25 | U1.P$31 54.57,90.27 55.77,91.47 57.45,91.47 | 57.45,91.47 | 67.37,89.92 | 67.37,89.92 65.83,91.47 57.45,91.47 | 73.15,84.25 73.04,84.25 | 73.15,84.25 | 73.15,84.25 73.04,84.25 | 73.04,84.25 67.37,89.92 | 87.12,84.25 86.87,84.25 | 86.87,84.25 73.15,84.25 | 86.87,84.25 | 86.87,84.25
LIMIT_SWITCH_3
  Top 0.203: 97.66,84.2 97.38,83.92 | 97.66,84.2 100.22,86.76 R53.2 101.97,87.12 LIMIT_SWITCH_3.1 | U1.P$30 54.85,89.99 56,91.14 57.31,91.14 | 57.31,91.14 | 67.04,89.78 | 67.04,89.78 65.69,91.14 57.31,91.14 | 67.04,89.78 72.9,83.92 97.38,83.92 | 97.38,83.92 97.66,84.2
LOGIC_3.3V  (via drill 0.35)
  Top 0.203: SCL_PULLUP.1 v97.79,73.41 | OE_PULLUP.1 v97.79,75.44 | SDA_PULLUP.1 v97.79,74.42 | PWM_DRIVER.28 v84.67,76.96 | U1.P$51 46.98,85.42 47.75,84.64 | U1.P$9 60.81,84.05 | 60.81,84.05 61.72,84.96 | 60.81,84.05 59.82,83.06 | C8.1 64.52,94.23 64.26,93.98
  Top 0.457: MAINLINE_CURRENT.1 38.94,28.02 39.37,28.45 39.88,28.45 | 39.88,28.45 42.16,28.45 43.27,27.09 C74.1 | v39.88,29.97 39.88,28.45 | U8.8 73.03,35.46 v73.41,35.84 | v67.06,37.85 66.8,37.59 C24.2 | U4.8 83.44,36.45 81.79,38.1 | 81.79,38.1 81.28,37.59 C27.2 | 81.79,38.1 79.2,40.69 v78.53,40.69 | U5.8 95.89,37.21 93.98,39.12 93.98,41.01 89.72,45.27 | 89.72,45.27 89.72,44.95 C30.2 | 89.72,45.27 86.83,48.16 86.83,58.24 v86.68,58.39 | U9.8 106.55,41.9 105.34,43.11 | C39.2 105,43.37 105.34,43.11 | v92.34,57.4 92.49,57.25 92.49,49.53 97.2,44.83 103.62,44.83 105.34,43.11 | U6.8 117.73,37.21 113.98,40.96 113.98,42.62 113.25,43.36 113.25,47.79 | 113.25,47.79 113.03,48.01 C33.2 | 113.25,47.79 113.25,48.55 v112.52,49.28 | U7.8 129.67,38.61 | 129.67,38.61 129.67,41.57 134.05,45.95 134.05,57.63 v133.86,57.83 | 129.46,38.78 129.67,38.57 | 129.46,38.78 C36.2 | 129.67,38.61 129.5,38.78 129.46,38.78
  Top 1.219: FAN.2 5.08,53.59 17.27,41.4 27.94,41.4 30.48,38.86 3.3V_DCDC_OKI.3
  Route15 0.457: v112.52,49.28 112.52,50.29 113.03,50.8 113.03,67.56 111.25,69.34 v108.97,69.34 | v133.86,57.83 133.86,68.58 135.13,69.85 v135.23,69.85
  Bottom 0.203: v84.67,76.96 84.67,82.9 84.84,83.06
  Bottom 0.457: ENCODER1.3 83.57,95.76 83.57,90.17 | ENCODER4.3 96.52,95.76 96.52,90.17 | 96.52,84.33 96.52,90.17 | 96.52,84.33 96.52,83.06 | 83.57,90.17 83.57,84.33 ENCODER3.3 | ENCODER2.3 83.57,90.17 | ENCODER5.3 96.52,90.17 | ENCODER6.3 96.52,84.33 | LIMIT_SWITCH_1.2 109.73,96.01 109.73,90.42 | 109.73,90.42 109.73,85.6 109.73,84.58 | LIMIT_SWITCH_3.2 109.73,84.58 | 109.73,84.58 109.73,83.82 | LIMIT_SWITCH_2.2 109.73,90.42 | 90.04,62.61 | 115.06,91.44 115.44,91.82 | 115.44,91.82 115.82,92.2 118.84,95.22 S5.P$2 | 115.44,91.82 115.57,91.69 128.27,91.69 | S4.P$1 143.74,91.69 134.34,91.69 | 128.27,91.69 134.34,91.69 | 134.34,91.69 S3.P$1 | S2.P$1 133.1,96.52 128.27,91.69 | v39.88,29.97 37.85,29.97 30.48,37.34 3.3V_DCDC_OKI.3 | 67.93,38.47 63.5,42.9 63.5,50.22 61.95,51.77 | v73.41,35.84 73.41,36.83 71.88,38.35 68.05,38.35 67.93,38.47 | 67.93,38.47 67.68,38.47 v67.06,37.85 | v78.53,40.69 77.82,41.4 66.29,41.4 64.52,43.18 64.52,50.55 62.63,52.44 | v86.68,58.39 88.65,60.36 v88.65,61.21 | v92.34,57.4 92.34,60.31 90.04,62.61 | v108.97,69.34 107.95,70.36 | v135.23,69.85 134.72,70.36 132.08,70.36
  Bottom 0.914: 97.28,69.85 97.79,70.36 | 97.79,70.36 107.95,70.36 132.08,70.36 | 97.79,70.36 v97.79,73.41 v97.79,74.42 v97.79,75.44 97.79,82.04 98.81,83.06 | 98.81,83.06 108.97,83.06 109.73,83.82 109.73,85.6 109.73,86.11 115.06,91.44 115.82,92.2 | 98.81,83.06 96.52,83.06 84.84,83.06 83.57,84.33 | v39.37,62.74 38.61,61.98 38.61,53.27 37.1,51.77
  Bottom 1.829: v88.65,61.21 90.04,62.61 | 90.04,62.61 97.28,69.85 | 90.04,62.61 90.01,62.58 87.03,62.58 86.61,62.99 73.41,62.99 69.52,59.11 69.3,59.11 62.63,52.44 61.95,51.77 37.1,51.77 36.4,51.06 35.69,50.36 32.69,47.36 28.7,47.36 28.7,47.24 28.19,46.74 28.19,44.45 30.48,42.16 3.3V_DCDC_OKI.3
  pour Top: 35.05,100.58 35.05,91.31 28.07,84.58 28.07,72.52 37.85,62.23 66.8,62.23 66.55,91.95 59.94,100.58
MAINLINE_CURRENT_SENSOR  (via drill 0.35)
  Top 0.152: 32.77,28.96 R59.1
  Top 0.203: U1.P$121 62.77,75.89 65.33,75.89 v65.53,75.69 | C75.1 33.11,30.73 44.57,30.73 46.59,28.71 52.79,28.71 56.88,32.8 56.88,35.97 57.16,36.25 57.36,36.25 v59.12,38.01
  Top 0.457: C75.1 33.27,30.48 33.53,30.23 33.53,29.21 33.27,28.96 32.77,28.96
  Route15 0.203: v59.12,38.01 57.49,39.65 57.49,53.51 63.14,59.16 67.53,59.16 69.3,60.93 69.3,61.79 v69.32,61.81
  Bottom 0.203: v65.53,75.69 65.61,75.62 65.61,71.04 68.33,68.33 68.33,64.77 69.32,63.78 v69.32,61.81
MASTER_POWER_ENABLE  (via drill 0.35)
  Top 0.152: R58.2 67.93,32.65
  Top 0.203: U1.P$109 58.24,73.63 58.24,72.94 57.95,72.64 57.95,71.88 59.15,70.69 61.22,70.69 61.55,70.36 v64.52,70.36
  Top 0.457: TRANSISTOR_DRIVER.4 67.8,32.38 R58.2 | 67.93,32.65 66.41,32.65 v65.02,34.04
  Route15 0.203: v65.02,34.04 63.75,34.04 60.86,36.93 59.35,36.93 57.16,39.12 57.16,53.65 63,59.49 66.61,59.49 68.3,61.18 v68.69,61.18
  Bottom 0.203: v64.52,70.36 64.66,70.51 65.68,70.51 68,68.19 68,61.88 v68.69,61.18
MOTOR1_1  (via drill 0.35)
  Top 2.159: v37.88,43.21 36.98,44.11 36.37,44.11 27.27,53.21 MOTOR1.C2
  Top 2.286: MOTOR1_HB.35 v37.88,43.21 37.08,42.42 37.08,34.29 v37.88,33.49 MOTOR1_HB.2
  Route2 2.159: v37.88,43.21 36.98,44.11 36.59,44.11 36.58,44.12 36.35,44.12 27.3,53.16 | 27.3,53.16 27.25,53.16 | MOTOR1.C2 27.25,53.21 arc-90 27.3,53.16
  Route2 2.286: v37.88,33.49 37.08,34.29 37.08,42.42 v37.88,43.21
  pour Top (no thermals): 41.1,34.29 41.1,32.69 38.81,32.69 38.81,34.29
  pour Top (rank 2, no thermals): 41.17,44.02 41.17,42.42 38.86,42.42 38.86,44.02
MOTOR1_2  (via drill 0.35)
  Top 1.829: v50.8,33.53 49.42,33.53 | MOTOR1_HB.20 v51.02,43.21
  Top 2.159: v51.02,43.21 52.07,42.16 52.07,34.8 v50.8,33.53 | v31.24,44.96 27.18,49.02 20.83,49.02 18.54,51.31 MOTOR1.C1
  Route2 2.159: v51.02,43.21 52.07,42.16 52.07,34.8 v50.8,33.53 | MOTOR1.C1 18.54,51.31 20.83,49.02 27.18,49.02 v31.24,44.96
  Route15 2.159: v51.02,43.21 49.06,45.18 49.06,45.4 49.02,45.44 49.02,45.67 45.29,49.4 38.16,49.4 33.71,44.96 v31.24,44.96
  Bottom 2.159: v51.02,43.21 49.06,45.18 49.06,45.62 45.32,49.36 40.12,49.36 38.09,49.36 33.69,44.96 v31.24,44.96
  pour Top (rank 2, no thermals): 47.9,34.29 47.9,32.69 50.29,32.69 50.29,34.29
  pour Top (no thermals): 50.22,44.04 50.22,42.44 48.01,42.44 48.01,44.04
MOTOR1_CURRENT_SENSOR  (via drill 0.35)
  Top 0.203: U1.P$123 62.82,76.98 62.82,76.83 63.37,76.28 64.14,76.28 64.61,76.75 v65,76.75
  Top 0.457: U8.7 74.3,36.2 73.91,36.58 71.79,36.58 | 71.79,36.58 71.26,37.11 v70.1,37.11 | C26.1 71.54,36.58 71.79,36.58
  Route15 0.203: v70.1,37.11 70.08,37.08 65.28,37.08 63.74,38.62 59.18,38.62 57.82,39.98 57.82,53.37 63.27,58.83 67.66,58.83 69.92,61.09 69.92,62.41 v69.94,62.43
  Bottom 0.203: v65,76.75 65.45,76.3 65.78,76.3 66.82,75.26 66.82,70.59 68.66,68.76 68.66,65.14 69.94,63.85 v69.94,62.43
MOTOR1_ENABLE  (via drill 0.35)
  Top 0.152: v52.32,69.6 51.56,69.6 51.31,69.85 51.31,70.1 U1.P$96 | v40.89,47.5
  Top 0.203: MOTOR1_HB.27 44.9,44.44 v45.04,44.58 | v40.89,47.5 36.07,52.32 v36.07,52.75
  Route15 0.203: v36.07,52.75 42.36,59.04 45.21,59.04 45.47,59.04 45.56,59.04 v45.8,59.27
  Bottom 0.152: v45.04,44.58 45.04,45.38 43.44,46.98 41.41,46.98 v40.89,47.5
  Bottom 0.203: v52.32,69.6 51.56,68.83 51.56,65.13 45.92,59.49 45.92,59.4 v45.8,59.27
MOTOR1_POWER  (via drill 0.35)
  Top 0.152: C23.2 59.69,40.82 59.69,39.88 | 62.23,41.15 61.72,40.64 61.72,39.88
  Top 1.219: C22.2 62.23,41.15 62.23,40.49 60.53,40.49 C23.2
  Top 1.829: 46.48,33.15 46.48,32 v47.52,30.96 | v42.42,45.97 42.42,44.71 42.53,44.6 42.53,43.88 42.6,43.81
  Top 2.159: v47.52,30.96 51.86,30.96 54.63,33.73 54.63,39.88 | 54.63,39.88 54.63,43.23 50.62,47.24 43.28,47.24 42.42,46.39 v42.42,45.97 | 54.63,39.88 59.69,39.88 61.72,39.88 76.71,39.88 79.25,37.34 79.25,30.23 v78.17,29.15
  Route2 2.159: v42.42,45.97 42.42,46.38 43.28,47.24 50.62,47.24 51.87,46 51.87,45.99 54.63,43.23 54.63,39.88 | 54.63,39.88 54.63,33.73 51.86,30.96 v47.52,30.96 | 54.63,39.88 76.71,39.88 79.25,37.34 79.25,30.23 v78.17,29.15
  pour Top (rank 2, no thermals): 77.98,27.69 75.34,27.69 75.34,30.15 77.98,30.15
  pour Top (no thermals): 47.6,34.29 47.6,32.69 45.29,32.69 45.29,34.29
  pour Top (no thermals): 43.76,44.02 43.76,42.42 41.48,42.42 41.48,44.02
MOTOR1_PWM1  (via drill 0.35)
  Top 0.203: 77.31,65.62 v77.22,65.53 77.8,66.12 87.38,66.12 87.92,66.67 PWM_DRIVER.6 | MOTOR1_HB.9 44.19,31.59 46.73,29.05 52.66,29.05 56.55,32.94 56.55,36.85 v56.83,37.13
  Route15 0.203: v77.22,65.53 77.22,65.02 76.45,64.26 75.44,64.26 75.16,64.54 71.7,64.54 71.66,64.5 71.16,64.5 69.02,62.37 | v56.83,37.13 56.83,37.49 57.11,37.76 57.11,38.27 56.83,38.54 56.83,53.78 62.87,59.82 66.47,59.82 69.02,62.37 | 69.02,62.37
MOTOR1_PWM2  (via drill 0.35)
  Top 0.203: v75.69,64.87 78.08,64.87 78.99,65.79 87.69,65.79 88.58,66.67 PWM_DRIVER.7 | MOTOR1_HB.10 44.84,31.4 46.87,29.38 52.52,29.38 56.22,33.08 56.22,37.74 v56.5,38.01
  Route15 0.203: v75.69,64.87 71.56,64.87 71.53,64.83 71.02,64.83 68.69,62.51 | v56.5,38.01 56.5,49.53 | 56.5,49.53 56.5,49.64 | 68.69,62.51 | 68.69,62.51 66.33,60.15 62.69,60.15 56.5,53.96 56.5,49.53
MOTOR2_1  (via drill 0.35)
  Top 1.829: MOTOR2_HB.2 81.5,55.91 v81.53,55.88 | MOTOR2_HB.35 81.5,46.19 v81.53,46.23
  Top 2.159: v81.53,55.88 82.55,54.86 82.55,47.24 v81.53,46.23 | v85.6,59.94 83.59,61.95 72.88,61.95 69.37,58.45 67.77,58.45 66.5,57.17 36.32,57.17 32.1,57.17 29.47,59.8 27.95,59.8 MOTOR2.C2
  Route2 2.159: v81.53,46.23 82.55,47.24 82.55,54.86 v81.53,55.88 | v85.6,59.94 83.59,61.95 72.9,61.95 72.88,61.94 69.39,58.45 67.77,58.45 66.5,57.17 32.1,57.17 29.46,59.82 27.94,59.82 MOTOR2.C2
  Route15 2.159: v85.6,59.94 v81.53,55.88
  Bottom 2.159: v81.53,55.88 v85.6,59.94
  pour Top (no thermals): 78.51,56.72 80.85,56.72 80.85,55.09 78.51,55.09
  pour Top (rank 2, no thermals): 78.49,46.99 80.8,46.99 80.8,45.36 78.49,45.36
MOTOR2_2  (via drill 0.35)
  Top 1.829: MOTOR2_HB.17 70.21,55.88 v68.83,55.88 | v68.83,46.23 68.87,46.19 MOTOR2_HB.20
  Top 2.159: v68.83,46.23 68.58,46.23 67.56,47.24 67.56,54.61 | 67.56,54.61 v68.83,55.88 | MOTOR2.C1 22.64,57.24 28.41,57.24 31.04,54.61 67.56,54.61
  Route2 2.159: v68.83,46.23 68.58,46.23 67.56,47.24 67.56,54.61 | 67.56,54.61 v68.83,55.88 | MOTOR2.C1 22.63,57.25 27.05,57.25 27.06,57.24 28.41,57.24 31.04,54.61 67.56,54.61
  pour Top (rank 2, no thermals): 69.39,56.72 71.73,56.72 71.73,55.12 69.39,55.12
  pour Top (no thermals): 69.37,46.99 71.63,46.99 71.63,45.39 69.39,45.39 69.39,46.96
MOTOR2_CURRENT_SENSOR  (via drill 0.35)
  Top 0.203: v65.53,77.47 64.87,77.47 64,76.61 63.5,76.61 63.15,76.97 63.15,77.21 U1.P$124 | v69.84,43.17 71.11,41.9 81.9,41.9 C29.1 82.56,38.09 84.71,35.94 U4.7
  Route15 0.203: 69.57,43.43 v69.84,43.17 69.07,43.94 67.06,43.94 65.46,45.54 65.46,56.15 70.55,61.25 70.55,63.04 v70.57,63.06
  Bottom 0.203: v65.53,77.47 67.15,75.85 67.15,70.73 68.99,68.89 68.99,65.28 | 69.16,65.1 68.99,65.28 | 69.16,65.1 70.57,63.7 v70.57,63.06 | 68.99,65.28 69.16,65.1
MOTOR2_ENABLE  (via drill 0.35)
  Top 0.203: MOTOR2_HB.27 74.8,46.13 v74.8,44.45 | U1.P$110 58.58,73.87 58.58,72.8 58.28,72.5 58.28,72.02 59.28,71.02 66.04,71.02 67.54,69.52 v69.34,69.52
  Route15 0.203: v74.8,44.45 74.8,43.05 74.42,42.67 72.14,42.67 69.85,44.96 68.07,44.96 65.79,47.24 65.79,56.02 71.17,61.41 71.17,63.66 v71.19,63.68
  Bottom 0.203: v69.34,69.52 69.32,69.49 69.32,65.53 71.17,63.68 v71.19,63.68
MOTOR2_POWER  (via drill 0.35)
  Top 0.61: C83.2 89.15,37.16 89.15,37.08 | C82.2 89.57,35.56 89.15,35.56
  Top 1.829: v72.9,58.17 72.9,56.51 | 77.1,46.19 77.1,43.62 77.54,43.62
  Top 2.159: 82.55,43.6 82.55,43.62 | v72.9,58.17 72.9,58.34 73.91,59.36 75.44,59.36 75.45,59.37 81.67,59.37 81.69,59.38 81.69,59.28 81.79,59.18 81.86,59.18 85.11,55.93 85.11,46.18 82.55,43.62 | 82.55,43.62 86.69,43.62 89.15,41.15 89.15,37.08 89.15,35.56 v89.15,29.97 88.33,29.15 U4.4 | 77.54,43.62 82.55,43.62
  Route2 2.159: 82.55,43.61 82.55,43.62 | 82.55,43.62 85.11,46.18 85.11,55.93 81.67,59.37 73.94,59.37 72.99,58.42 72.99,58.26 v72.9,58.17 | v89.15,29.97 89.15,41.15 86.69,43.62 82.55,43.62 | 82.55,43.62 77.54,43.62 v77.47,43.69
  pour Top (rank 2, no thermals): 88.14,30.23 85.6,30.23 85.6,27.94 88.14,27.94
  pour Top (no thermals): 72.01,56.69 74.35,56.69 74.35,55.12 72.01,55.12
  pour Top (no thermals): 75.84,47.02 78.18,47.02 78.18,45.39 75.84,45.39
MOTOR2_PWM1  (via drill 0.35)
  Top 0.203: MOTOR2_HB.9 v75.45,57.38 v75.44,57.38 | v80.01,65.02 87.39,65.02 89.22,66.85 PWM_DRIVER.8
  Route15 0.203: v75.44,57.38 75.44,60.45 v80.01,65.02
MOTOR2_PWM2  (via drill 0.35)
  Top 0.203: PWM_DRIVER.9 89.9,69.96 89.9,67.06 87.25,64.41 v78.49,64.41 | MOTOR2_HB.10 74.8,54.48 v74.68,54.36
  Route15 0.203: 78.49,64.26 v78.49,64.41 74.57,60.5 74.57,57.76 74.68,57.66 v74.68,54.36
MOTOR3_1  (via drill 0.35)
  Top 1.829: 163.44,81.79 v161.8,81.79 | MOTOR3_HB.35 v161.83,91.47
  Top 2.159: v161.8,81.79 161.04,82.55 161.04,90.68 v161.83,91.47
  Route2 2.159: v161.83,91.47 161.04,90.68 161.04,82.55 v161.8,81.79
  Route15 2.159: MOTOR3.C2 165.61,76.96 161.8,80.77 v161.8,81.79
  Bottom 2.159: v161.8,81.79 161.8,80.77 165.61,76.96 MOTOR3.C2
  pour Top (no thermals): 162.48,80.92 162.48,82.58 164.82,82.58 164.82,80.95 162.51,80.95
  pour Top (rank 2, no thermals): 162.56,90.68 162.56,92.28 164.87,92.28 164.87,90.68
MOTOR3_2  (via drill 0.35)
  Top 1.829: MOTOR3_HB.17 v174.72,81.75 173.75,81.75 MOTOR3_HB.18 | MOTOR3_HB.20 v174.72,91.47
  Top 2.159: v174.72,91.47 175.51,90.68 175.51,82.55 v174.72,81.75 173.48,80.52 MOTOR3.C1
  Route2 2.159: v174.72,91.47 175.51,90.68 175.51,82.55 174.75,81.79 | MOTOR3.C1 173.48,80.52 v174.72,81.75
  pour Top (no thermals): 171.68,90.68 171.68,92.3 173.91,92.3 173.91,90.68
  pour Top (rank 2, no thermals): 171.6,80.92 171.6,82.55 173.94,82.55 173.94,80.95 171.63,80.95
MOTOR3_CURRENT_SENSOR  (via drill 0.35)
  Top 0.203: U1.P$126 63.39,78.1 v63.92,78.1 | U5.7 97.03,34.48 97.03,38.61 95.67,39.97 C32.1 95.5,40.13 87.29,48.35 87.29,60.89 v87.02,61.16
  Route15 0.203: v77.42,68.55 77.81,68.55 79.52,66.84 80.3,66.84 82.57,64.57 84.83,64.57 86.11,63.29 86.11,63.25 86.87,62.48 86.87,61.31 v87.02,61.16
  Bottom 0.203: v77.42,68.55 77.17,68.8 76.78,68.8 76.2,69.38 76.2,71.75 71.22,76.73 69.69,76.73 67.94,78.49 64.3,78.49 v63.92,78.1
MOTOR3_ENABLE  (via drill 0.35)
  Top 0.203: MOTOR3_HB.27 168.6,93.43 v168.67,93.5 | U1.P$15 59.06,85.72 60.85,87.5 61.23,87.5 | v81.59,79.97 81.32,80.25 71.44,80.25 64.18,87.5 61.23,87.5 | 61.23,87.5
  Route15 0.203: v168.67,93.5 168.67,94.22 167.39,95.5 160.27,95.5 155.45,90.68 146.81,90.68 141.48,85.34 116.84,85.34 111,79.5 82.06,79.5 v81.59,79.97
MOTOR3_POWER  (via drill 0.35)
  Top 0.61: C78.2 101.6,34.04 | C79.2 101.6,36.65 101.6,36.32
  Top 1.829: v170.43,79.76 170.43,80.18 170.24,80.37 170.24,81.22 170.18,81.28 | v166.12,93.22 166.12,92.97 166.23,92.86 166.23,91.95
  Top 2.159: U5.4 100.52,29.15 v101.09,29.72 101.6,30.23 101.6,34.04 101.6,36.32 101.6,41.03 99.95,42.67 95.25,42.67 88.88,49.05 88.88,58.4 102.2,71.72 149.95,71.72 158.47,80.24 | 158.47,80.24 158.47,91.74 160.77,94.04 165.34,94.04 165.4,93.98 | 165.61,93.73 v166.12,93.22 | 158.47,80.24 161.24,77.47 169.16,77.47 170.43,78.74 v170.43,79.76
  Route2 2.159: v101.09,29.72 101.6,30.23 101.6,41.03 99.95,42.67 95.25,42.67 88.9,49.02 88.9,58.42 102.21,71.73 149.96,71.73 158.47,80.24 | v166.12,93.22 165.29,94.04 160.77,94.04 158.47,91.74 158.47,80.24 | 158.47,80.24 161.24,77.47 169.16,77.47 170.42,78.73 170.42,79.74 v170.43,79.76
  pour Top (rank 2, no thermals): 98.04,30.23 98.04,27.69 100.58,27.69 100.58,30.23
  pour Top (no thermals): 165.15,90.68 165.15,92.28 167.46,92.28 167.46,90.68
  pour Top (no thermals): 168.99,80.95 168.99,82.58 171.32,82.58 171.32,80.95
MOTOR3_PWM1  (via drill 0.35)
  Top 0.203: MOTOR3_HB.9 167.89,79.78 167.88,79.77 167.88,79.54 v167.67,79.33 | PWM_DRIVER.10 90.5,69.96 90.5,67.02 91.05,66.47 92.38,66.47 99.21,73.3 124.1,73.3 124.11,73.31 124.2,73.31 124.81,73.91 v126.24,73.91
  Route15 0.203: v126.24,73.91 126.67,73.48 133.53,73.48 137.67,69.34 167.13,69.34 168.66,70.87 168.66,77.98 167.67,78.96 v167.67,79.33
MOTOR3_PWM2  (via drill 0.35)
  Top 0.203: MOTOR3_HB.10 168.54,79.52 v168.56,79.5 | PWM_DRIVER.11 91.17,68.58 90.83,68.24 90.83,67.16 91.19,66.8 92.24,66.8 99.08,73.64 123.67,73.64 v123.95,73.91
  Route15 0.203: v123.95,73.91 124.97,73.91 125.73,73.15 133.39,73.15 137.53,69.01 167.27,69.01 168.99,70.73 168.99,78.11 168.56,78.55 v168.56,79.5
MOTOR4_1  (via drill 0.35)
  Top 1.829: MOTOR4_HB.35 99.34,59.94 v97.79,59.94 | MOTOR4_HB.2 99.29,50.29 98.04,50.29
  Top 2.159: v97.79,59.94 96.77,58.93 96.77,51.31 v97.03,51.05 97.79,50.29 98.04,50.29 | 103.76,64.64 v103.63,64.52 111.24,64.52 111.54,64.82 165.02,64.82 MOTOR4.C2
  Route2 2.159: 98.04,50.29 97.79,50.29 v97.03,51.05 96.77,51.31 96.77,58.93 v97.79,59.94 | 103.76,64.64 v103.63,64.52 111.25,64.52 111.51,64.77 111.56,64.82 165.02,64.82 MOTOR4.C2
  Route15 2.159: v97.79,59.94 102.36,64.52 v103.63,64.52
  Bottom 2.159: v103.63,64.52 102.36,64.52 v97.79,59.94
  pour Top (no thermals): 100.74,49.45 98.48,49.45 98.48,51.08 100.74,51.08
  pour Top (rank 2, no thermals): 100.86,60.83 100.86,59.18 97.87,59.16 97.87,60.81
MOTOR4_2  (via drill 0.35)
  Top 1.829: MOTOR4_HB.17 109.08,50.29 v110.49,50.29 | MOTOR4_HB.20 109.08,59.94 v110.49,59.94
  Top 2.159: v110.49,59.94 110.74,59.94 111.76,58.93 | v110.49,50.29 111.76,51.56 111.76,58.93 | 111.76,58.93 115.09,62.26 163.06,62.26 163.94,61.38 169.46,61.38 MOTOR4.C1
  Route2 2.159: v110.49,50.29 111.76,51.56 111.76,58.93 | v110.49,59.94 110.74,59.94 111.76,58.93 | MOTOR4.C1 169.46,61.38 163.94,61.38 163.06,62.26 115.09,62.26 111.76,58.93
  pour Top (rank 2, no thermals): 109.93,49.43 107.67,49.43 107.67,51.05 109.93,51.05
  pour Top (no thermals): 109.93,59.18 107.7,59.18 107.7,60.78 109.93,60.78
MOTOR4_CURRENT_SENSOR  (via drill 0.35)
  Top 0.203: U1.P$127 63.32,78.74 64.01,78.74 v64.52,79.25 | U9.7 107.82,41.15 107.82,41.27 | 106.43,43.78 106.68,43.78 | 106.43,43.78 106.27,43.78 | 106.68,43.78 C41.1 | v105.41,44.68 105.78,44.68 106.68,43.78 | 107.82,41.27 | 107.82,41.27 106.43,42.67 106.43,43.78 | 106.43,43.78
  Route15 0.203: v77.03,69.41 77.42,69.41 79.66,67.17 80.44,67.17 82.71,64.9 84.96,64.9 86.11,63.75 88.65,63.75 90.42,61.98 90.42,49.36 95.74,44.04 100.74,44.04 101.38,44.68 v105.41,44.68
  Bottom 0.203: v64.52,79.25 67.65,79.25 69.83,77.06 71.35,77.06 77.03,71.39 v77.03,69.41
MOTOR4_ENABLE  (via drill 0.35)
  Top 0.203: MOTOR4_HB.27 104.59,61.89 v104.66,61.97 | U1.P$116 59.66,76.24 61.66,74.24 61.82,74.24 v62.33,73.73
  Route15 0.203: v62.33,73.73 62.45,73.73 63.25,72.92 64.79,72.92 66.69,71.03 75.32,71.03 76.32,70.03 77.26,70.03 79.79,67.5 80.58,67.5 82.85,65.23 90.3,65.23 91.53,64 97.11,64 v97.49,64.37
  Bottom 0.203: v104.66,61.97 104.66,63.7 104.94,63.97 104.94,65.06 104.17,65.82 101.82,65.82 100.37,64.37 v97.49,64.37
MOTOR4_POWER  (via drill 0.35)
  Top 0.457: 102.38,61.7 102.12,61.7
  Top 0.61: C21.2 112.45,36.32 112.27,36.32 | C20.2 112.27,33.27
  Top 1.219: C21.2 112.7,36.5 112.52,36.32
  Top 1.651: 106.68,48.43 106.68,48.55 106.32,48.91 106.32,49.48 106.2,49.61 106.2,49.13
  Top 1.829: 102.38,60.71 102.38,61.7 101.98,62.11 | v106.68,48.01 106.68,48.43 106.34,48.77